# EAGLE board smartstand-usb-dac-amplifier-rev-b (EAGLE 9.2.2)
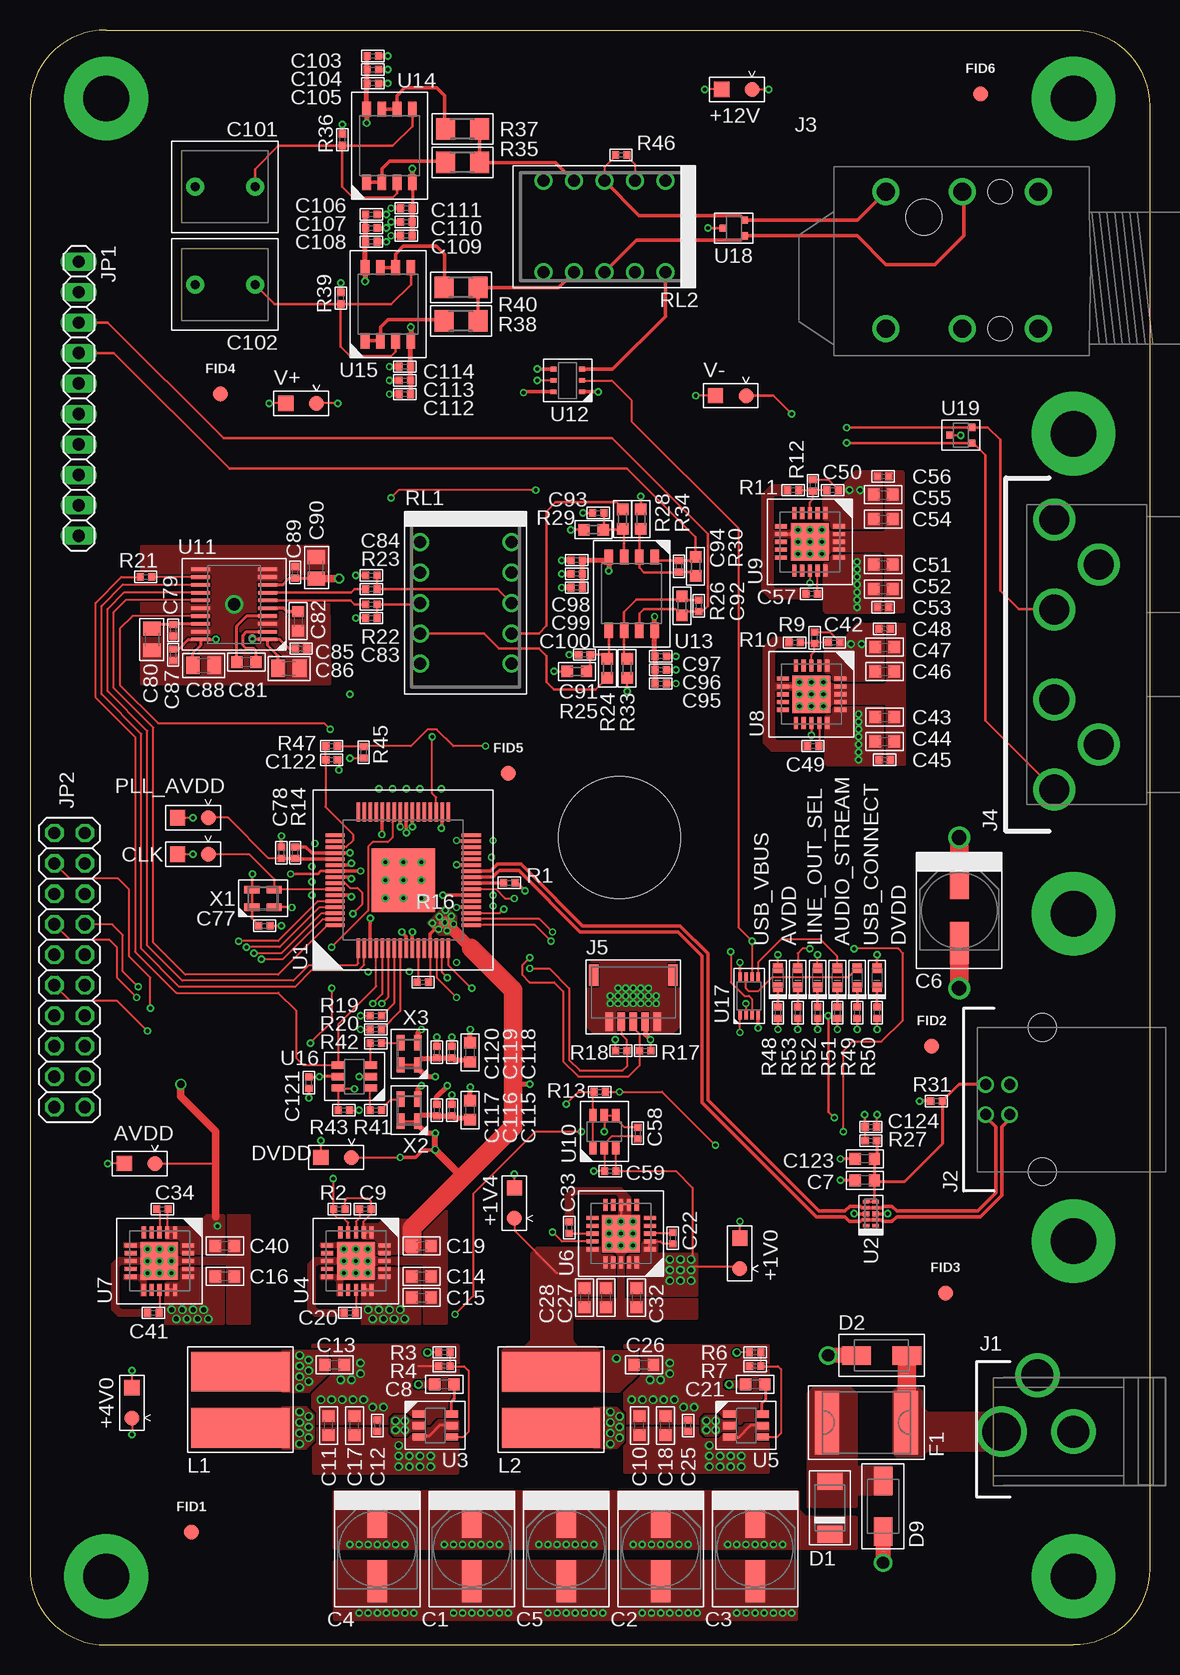
[diagram p12: board, top side]
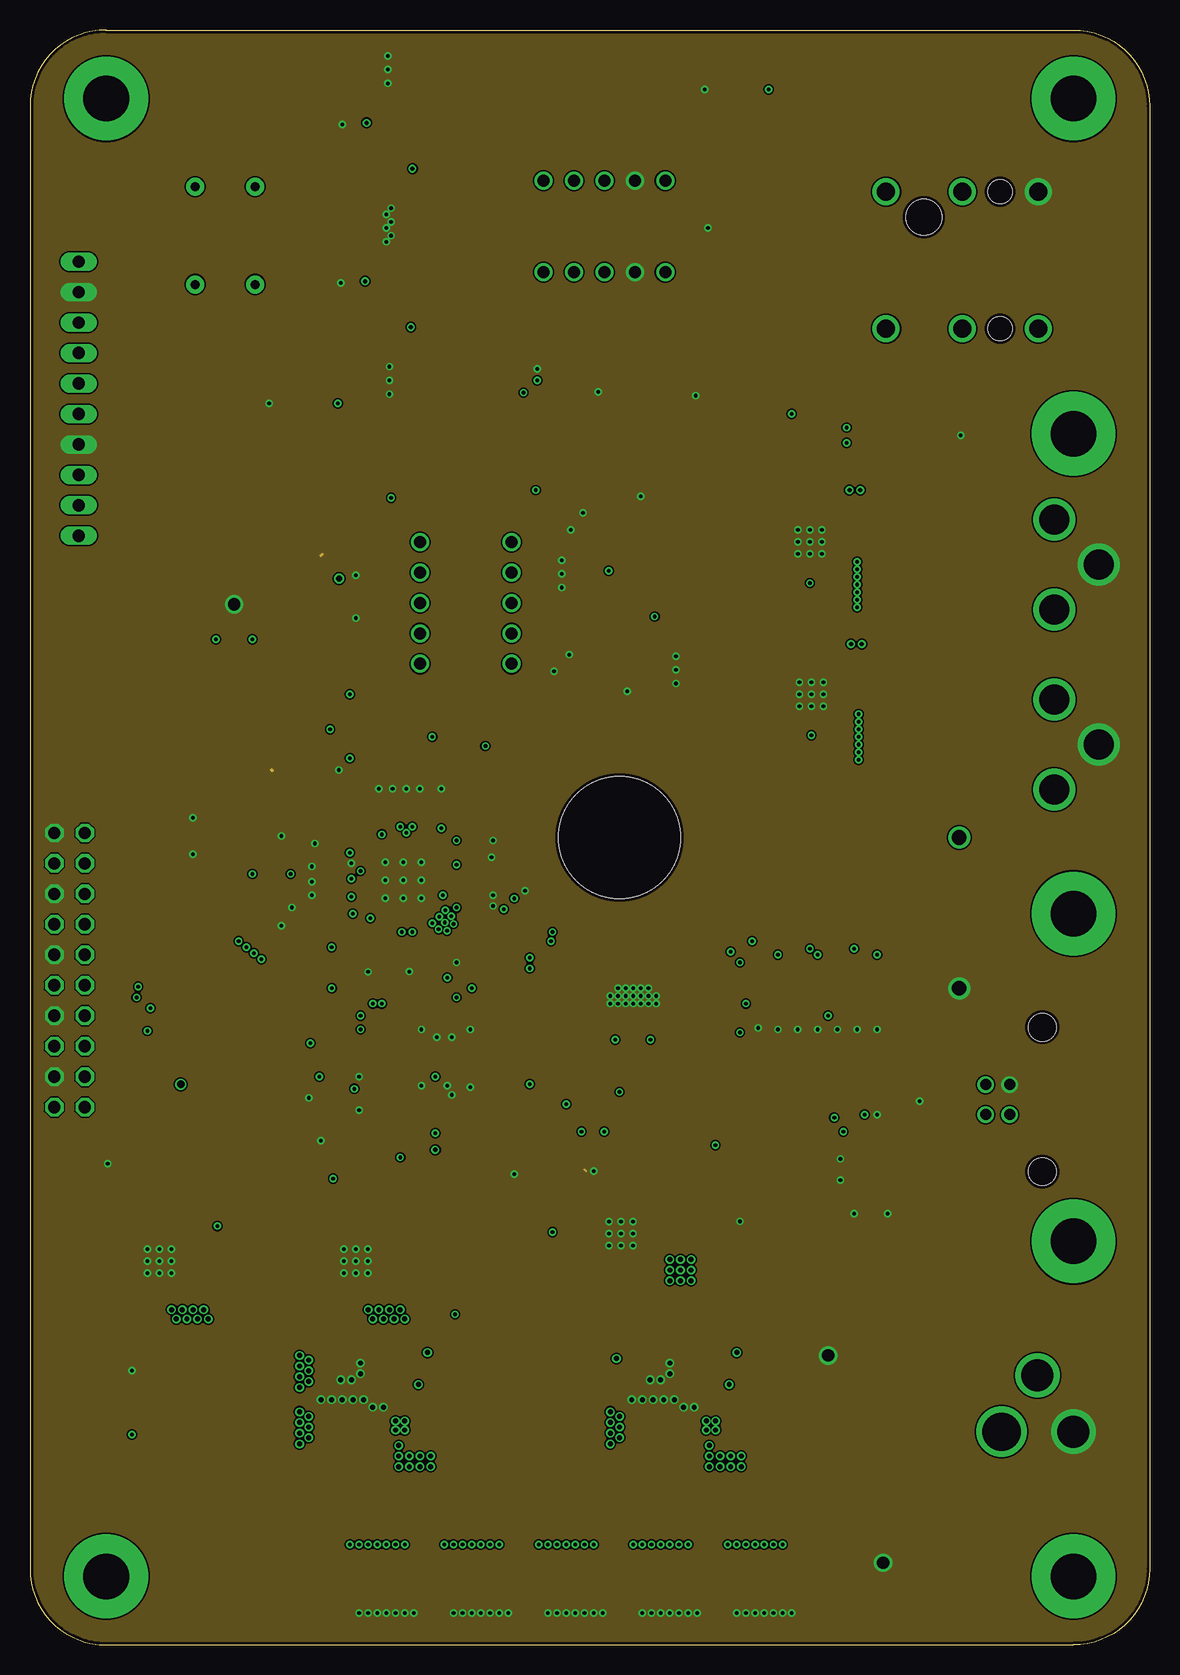
[diagram p13: board, inner layer Route2]
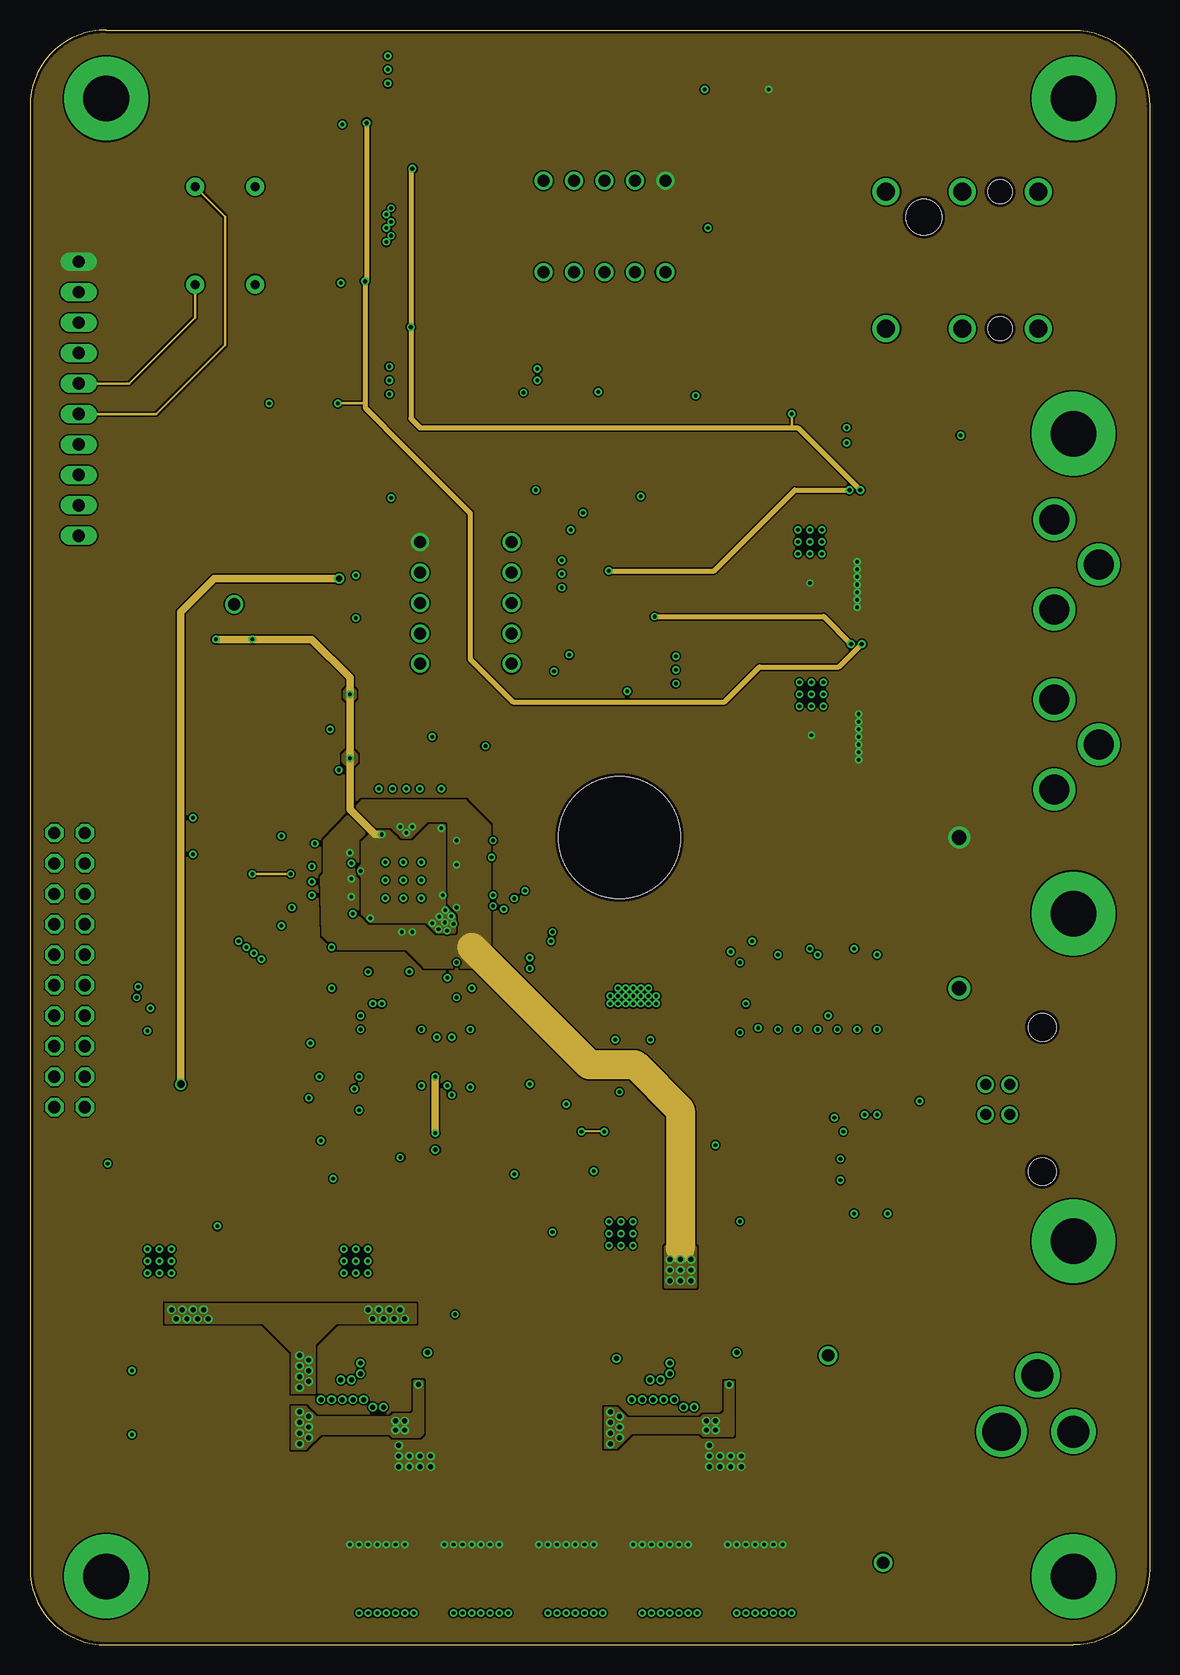
[diagram p14: board, inner layer Route15]
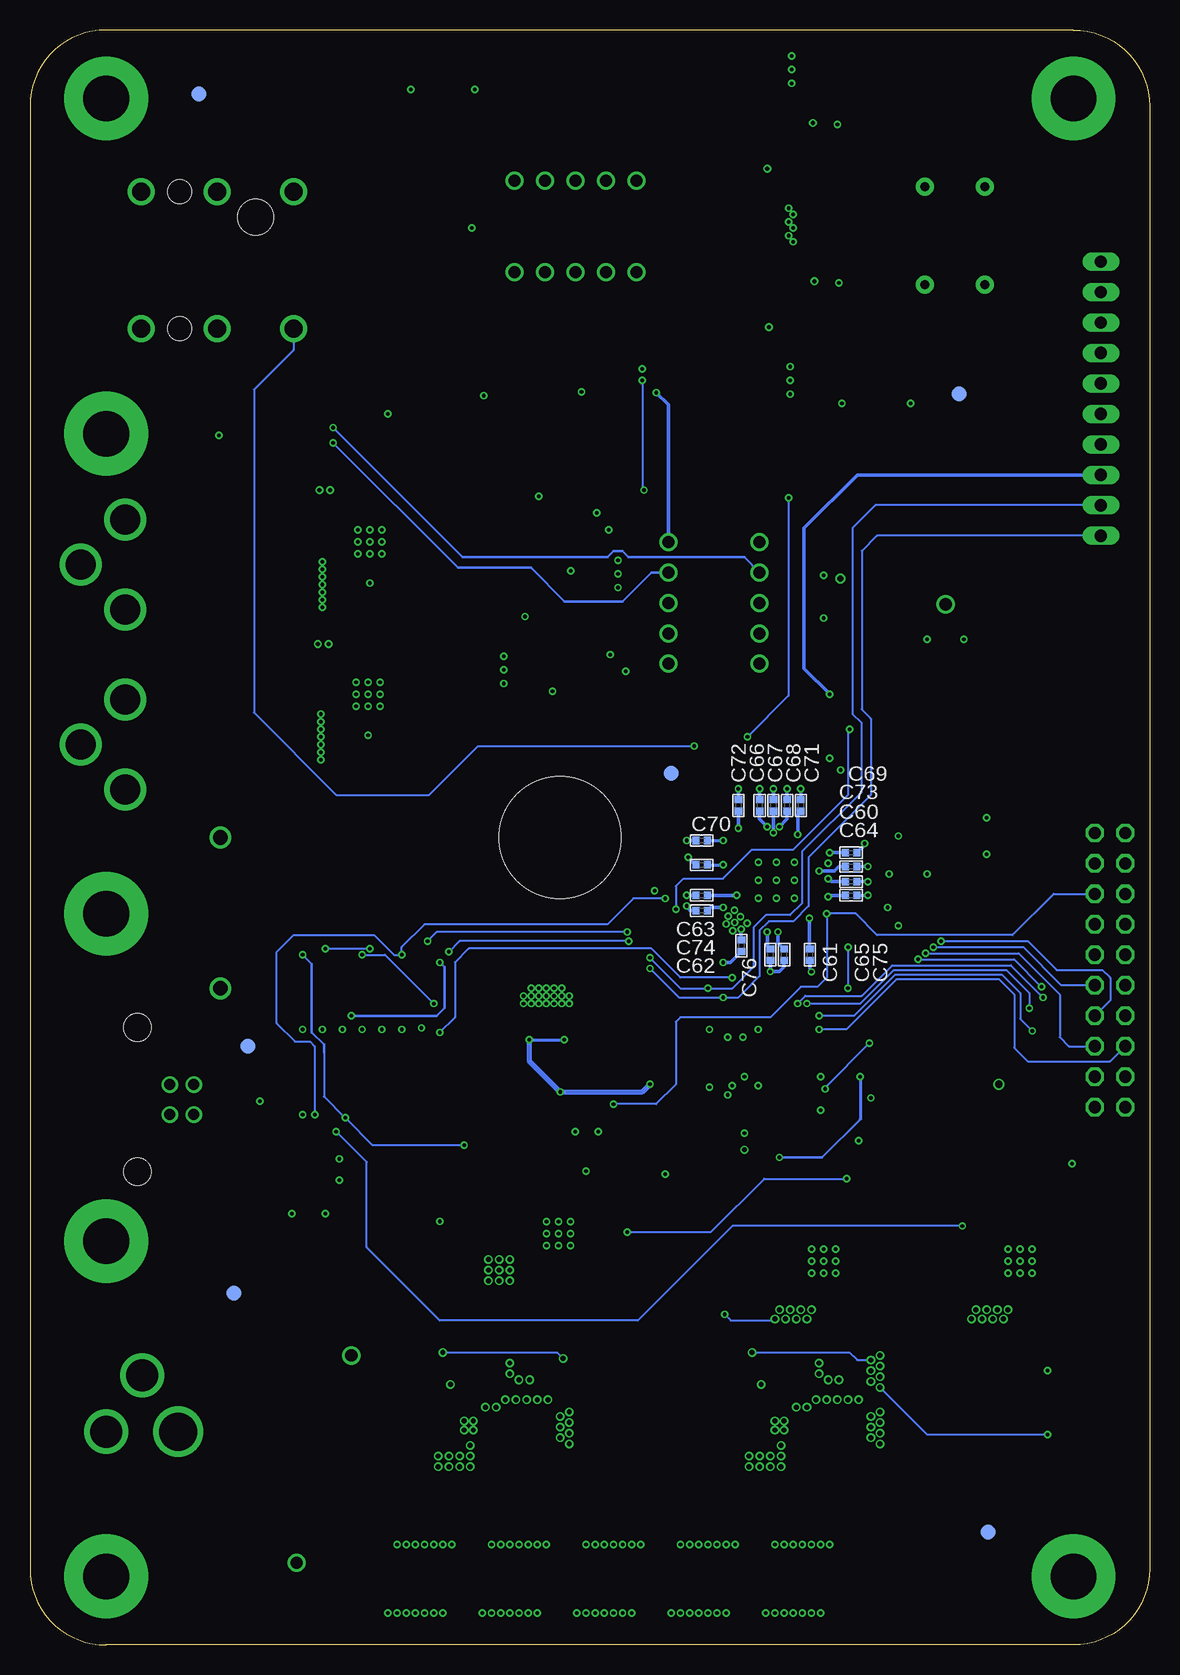
[diagram p15: board, bottom side, seen from below]

Size 93.34 x 134.62 mm. Coordinates in mm from the lower left corner, seen from the top.
Outline: 6.35,134.62 87,134.62 arc-90 93.34,128.27 93.34,6.35 arc-90 87,0 6.35,0 arc-90 0,6.35 0,128.27 arc-90 6.35,134.62
Copper layers (1*2*15*16): Top 0.035mm / dielectric 0.23mm / Route2 0.035mm / dielectric 0.93mm / Route15 0.035mm / dielectric 0.23mm / Bottom 0.035mm
Design rules "MF_Standard_4_Layer": minimum track width 5mil, minimum drill 12mil, track to track 5mil, track to pad 5mil, pad to pad 5mil, via to via 5mil, smd to smd 0mil, copper to edge 10mil, drill to drill 10mil, minimum pad ring 6mil, minimum via ring 6mil, stop-mask expansion 2mil, vias tented up to drill 25mil, thermal gap 10mil
Net classes: 0 default: width 0.152 mm, drill 0.254 mm; 1 USB: width 0.279 mm, drill 0.254 mm; 2 audio_post: clearance 0.381 mm
Holes 10.16 mm at 49.15,67.31

## Footprints (pad centres in the part's own frame; a part is rotated, then mirrored left to right if it is on the bottom)
CHEMICON_F55 = smd 3.5 x 1.6: + -2.7,0; - 2.7,0
C0603 = smd 0.95 x 1: 1 -0.8,0; 2 0.8,0
C0402 = smd 0.59 x 0.64: 1 -0.48,0; 2 0.48,0
C0805 = smd 1.15 x 1.45: 1 -0.9,0; 2 0.9,0
KEMET-5MM-6.0-7.2 = drill 0.75 pad 1.5: P$1 -2.5,0; P$2 2.5,0
SOD128 = smd 1.4 x 2.1: A 2.2,0; C -2.2,0
SMA = smd 2.4 x 1.55: A 2.1,0; C -2.1,0
DIALIGHT-0603 = smd 0.8 x 0.8: 1 -0.8,0; 2 0.8,0
2920L = smd 2 x 5.3: P$1 -3.3,0; P$2 3.3,0
FIDUCIAL_100MIL = smd 1.27 x 1.27: P$1 0,0 | smd 1.27 x 1.27 bottom: P$2 0,0
PJ-002A = drill 3.175: 1 -3,0 | drill 2.667: 2 3,0; 3 0,4.7
292304 = drill 0.92: P$1 1.25,9.6; P$2 -1.25,9.6; P$3 -1.25,7.6; P$4 1.25,7.6 | hole 2.3: -6.02,4.89; 6.02,4.89
NRJ6HH = drill 1.5: R 0,7.23; RN 0,-4.2; S 6.35,7.23; SN 6.35,-4.2; T -6.35,7.23; TN -6.35,-4.2 | hole 2: 3.15,7.23; 3.15,-4.2 | hole 3: -3.2,5.1
PJRAN2X1U = drill 2.5: L_SHUNT 11.25,3.7; L_SLEEVE 7.5,0; L_TIP 3.75,3.7; R_SHUNT -3.75,3.7; R_SLEEVE -7.5,0; R_TIP -11.25,3.7
T1M-SINGLE-5POS = smd 0.6 x 1.55: 1 2,-2.781; 2 1,-2.781; 3 0,-2.781; 4 -1,-2.781; 5 -2,-2.781 | smd 0.8 x 1.8: G1 3.3,1.094; G2 -3.3,1.094
1X10 = drill 1.016 long: 1 -11.43,0; 2 -8.89,0; 3 -6.35,0; 4 -3.81,0; 5 -1.27,0; 6 1.27,0; 7 3.81,0; 8 6.35,0; 9 8.89,0; 10 11.43,0
2X10 = drill 1.016 octagon: 1 -11.43,-1.27; 2 -11.43,1.27; 3 -8.89,-1.27; 4 -8.89,1.27; 5 -6.35,-1.27; 6 -6.35,1.27; 7 -3.81,-1.27; 8 -3.81,1.27; 9 -1.27,-1.27; 10 -1.27,1.27; 11 1.27,-1.27; 12 1.27,1.27; 13 3.81,-1.27; 14 3.81,1.27; 15 6.35,-1.27; 16 6.35,1.27; 17 8.89,-1.27; 18 8.89,1.27; 19 11.43,-1.27; 20 11.43,1.27
TDK-VLP8040 = smd 3.3 x 8.2: P$1 -2.35,0; P$2 2.35,0
R0402 = smd 0.59 x 0.64: 1 -0.48,0; 2 0.48,0
R0603 = smd 0.95 x 0.95: 1 -0.8,0; 2 0.8,0
R1206 = smd 1.6 x 1.803: 1 -1.422,0; 2 1.422,0
TQ2 = drill 1: P$1 -5.08,-3.81; P$2 -2.54,-3.81; P$3 0,-3.81; P$4 2.54,-3.81; P$5 5.08,-3.81; P$6 5.08,3.81; P$7 2.54,3.81; P$8 0,3.81; P$9 -2.54,3.81; P$10 -5.08,3.81
TESTPOINT-1.5-WITH-GND = smd 1.27 x 1.27: G 1.27,0; S -1.27,0
TQFP-64-EXPOSED-PAD = smd 0.28 x 1.6: P$1 -3.75,-5.68; P$2 -3.25,-5.68; P$3 -2.75,-5.68; P$4 -2.25,-5.68; P$5 -1.75,-5.68; P$6 -1.25,-5.68; P$7 -0.75,-5.68; P$8 -0.25,-5.68; P$9 0.25,-5.68; P$10 0.75,-5.68; P$11 1.25,-5.68; P$12 1.75,-5.68; P$13 2.25,-5.68; P$14 2.75,-5.68; P$15 3.25,-5.68; P$16 3.75,-5.68; P$33 3.75,5.68; P$34 3.25,5.68; P$35 2.75,5.68; P$36 2.25,5.68; P$37 1.75,5.68; P$38 1.25,5.68; P$39 0.75,5.68; P$40 0.25,5.68; P$41 -0.25,5.68; P$42 -0.75,5.68; P$43 -1.25,5.68; P$44 -1.75,5.68; P$45 -2.25,5.68; P$46 -2.75,5.68; P$47 -3.25,5.68; P$48 -3.75,5.68 | smd 1.6 x 0.28: P$17 5.68,-3.75; P$18 5.68,-3.25; P$19 5.68,-2.75; P$20 5.68,-2.25; P$21 5.68,-1.75; P$22 5.68,-1.25; P$23 5.68,-0.75; P$24 5.68,-0.25; P$25 5.68,0.25; P$26 5.68,0.75; P$27 5.68,1.25; P$28 5.68,1.75; P$29 5.68,2.25; P$30 5.68,2.75; P$31 5.68,3.25; P$32 5.68,3.75; P$49 -5.68,3.75; P$50 -5.68,3.25; P$51 -5.68,2.75; P$52 -5.68,2.25; P$53 -5.68,1.75; P$54 -5.68,1.25; P$55 -5.68,0.75; P$56 -5.68,0.25; P$57 -5.68,-0.25; P$58 -5.68,-0.75; P$59 -5.68,-1.25; P$60 -5.68,-1.75; P$61 -5.68,-2.25; P$62 -5.68,-2.75; P$63 -5.68,-3.25; P$64 -5.68,-3.75 | smd 5.31 x 5.31: P$65 0,0 | drill 0.305 pad 0.61: P$66 -1.5,1.5; P$67 0,1.5; P$68 1.5,1.5; P$69 -1.5,0; P$70 0,0; P$71 1.5,0; P$72 -1.5,-1.5; P$73 0,-1.5; P$74 1.5,-1.5
R-PUSON-N10 = smd 0.3 x 0.55: P$1 -1,-0.385; P$2 -0.5,-0.385; P$4 0.5,-0.385; P$5 1,-0.385; P$6 1,0.385; P$7 0.5,0.385; P$9 -0.5,0.385; P$10 -1,0.385 | smd 0.4 x 0.55: P$3 0,-0.385; P$8 0,0.385
R-PDSO-G6-DBV = smd 0.6 x 1.1: 1 -0.95,-1.35; 2 0,-1.35; 3 0.95,-1.35; 4 0.95,1.35; 5 0,1.35; 6 -0.95,1.35
S-PVQFN-N20 = smd 0.35 x 1: P$1 -1.3,-2.4; P$2 -0.65,-2.4; P$3 0,-2.4; P$4 0.65,-2.4; P$5 1.3,-2.4; P$11 1.3,2.4; P$12 0.65,2.4; P$13 0,2.4; P$14 -0.65,2.4; P$15 -1.3,2.4 | smd 1 x 0.35: P$6 2.4,-1.3; P$7 2.4,-0.65; P$8 2.4,0; P$9 2.4,0.65; P$10 2.4,1.3; P$16 -2.4,1.3; P$17 -2.4,0.65; P$18 -2.4,0; P$19 -2.4,-0.65; P$20 -2.4,-1.3 | drill 0.305 pad 0.406: P$21 0,0; P$22 -1,0; P$23 1,0; P$24 1,1; P$25 0,1; P$26 -1,1; P$27 -1,-1; P$28 0,-1; P$29 1,-1 | smd 3.15 x 3.15: P$EP 0,0
R-PDSO-G20 = smd 0.3 x 1.6: P$1 -2.925,-2.8; P$2 -2.275,-2.8; P$3 -1.625,-2.8; P$4 -0.975,-2.8; P$5 -0.325,-2.8; P$6 0.325,-2.8; P$7 0.975,-2.8; P$8 1.625,-2.8; P$9 2.275,-2.8; P$10 2.925,-2.8; P$11 2.925,2.8; P$12 2.275,2.8; P$13 1.625,2.8; P$14 0.975,2.8; P$15 0.325,2.8; P$16 -0.325,2.8; P$17 -0.975,2.8; P$18 -1.625,2.8; P$19 -2.275,2.8; P$20 -2.925,2.8
SOT-457 = smd 0.5 x 0.4: 1 -1.2,0.95; 2 -1.2,0; 3 -1.2,-0.95; 4 1.2,-0.95; 5 1.2,0; 6 1.2,0.95
DMP8 = smd 0.72 x 1.27: P$1 -1.905,-3.05; P$2 -0.635,-3.05; P$3 0.635,-3.05; P$4 1.905,-3.05; P$5 1.905,3.05; P$6 0.635,3.05; P$7 -0.635,3.05; P$8 -1.905,3.05
R-PDSO-G8-DCU = smd 0.3 x 0.8: 1 -0.75,-1.55; 2 -0.25,-1.55; 3 0.25,-1.55; 4 0.75,-1.55; 5 0.75,1.55; 6 0.25,1.55; 7 -0.25,1.55; 8 -0.75,1.55
R-PDSO-G3 = smd 0.6 x 0.55: 1 0.65,0.925; 2 -0.65,0.925; 3 0,-0.925
KC2520C = smd 1.27 x 0.635: P$1 -0.925,-0.725; P$2 0.925,-0.725; P$3 0.925,0.725; P$4 -0.925,0.725

## Placement (x,y rotation side)
C1  47uF  [CHEMICON_F55]  36.83,8 270 top
C2  47uF  [CHEMICON_F55]  52.58,8 270 top
C3  47uF  [CHEMICON_F55]  60.45,8 270 top
C4  47uF  [CHEMICON_F55]  28.96,8 270 top
C5  47uF  [CHEMICON_F55]  44.7,8 270 top
C6  47uF  [CHEMICON_F55]  77.47,61.21 270 top
C7  1uF  [C0603]  69.6,38.73 180 top
C8  0.1uF  [C0603]  34.54,21.72 180 top
C9  0.01uF  [C0402]  27.94,36.32 180 top
C10  10uF  [C0603]  50.8,18.29 90 top
C11  10uF  [C0603]  24.89,18.29 90 top
C12  0.1uF  [C0402]  28.96,18.29 90 top
C13  22uF  [C0603]  25.4,23.37 0 top
C14  22uF  [C0603]  32.64,30.73 0 top
C15  22uF  [C0603]  32.64,28.96 0 top
C16  22uF  [C0603]  16.26,30.73 0 top
C17  10uF  [C0603]  27.05,18.29 90 top
C18  10uF  [C0603]  52.96,18.29 90 top
C19  22uF  [C0603]  32.64,33.27 0 top
C20  0.01uF  [C0402]  26.67,27.69 180 top
C21  0.1uF  [C0603]  60.45,21.72 180 top
C22  0.01uF  [C0402]  53.59,33.91 90 top
C25  0.1uF  [C0402]  54.86,18.29 90 top
C26  22uF  [C0603]  51.18,23.37 0 top
C27  22uF  [C0603]  48.01,28.96 270 top
C28  22uF  [C0603]  46.23,28.96 270 top
C32  22uF  [C0603]  50.55,28.96 270 top
C33  0.01uF  [C0402]  44.96,34.8 90 top
C34  0.01uF  [C0402]  11.05,36.32 180 top
C40  22uF  [C0603]  16.26,33.27 0 top
C41  0.01uF  [C0402]  10.29,27.69 180 top
C42  0.01uF  [C0402]  67.06,83.57 180 top
C43  22uF  [C0603]  71.25,77.34 0 top
C44  1uF  [C0603]  71.25,75.31 0 top
C45  0.1uF  [C0402]  71.25,73.79 0 top
C46  22uF  [C0603]  71.25,81.15 0 top
C47  1uF  [C0603]  71.25,83.19 0 top
C48  0.1uF  [C0402]  71.25,84.71 0 top
C49  0.01uF  [C0402]  65.28,74.93 180 top
C50  0.01uF  [C0402]  66.93,96.27 180 top
C51  22uF  [C0603]  71.12,90.04 0 top
C52  1uF  [C0603]  71.12,88.01 0 top
C53  0.1uF  [C0402]  71.12,86.49 0 top
C54  22uF  [C0603]  71.12,93.85 0 top
C55  1uF  [C0603]  71.12,95.89 0 top
C56  0.1uF  [C0402]  71.12,97.41 0 top
C57  0.01uF  [C0402]  65.15,87.63 180 top
C58  0.01uF  [C0402]  50.67,42.67 90 top
C59  0.01uF  [C0402]  48.39,39.5 0 top
C60  0.1uF  [C0402]  24.89,63.63 0 bottom
C61  0.1uF  [C0402]  31.62,57.53 270 bottom
C62  0.1uF  [C0402]  37.34,61.21 180 bottom
C63  0.1uF  [C0402]  37.34,65.02 180 bottom
C64  0.1uF  [C0402]  24.89,62.48 0 bottom
C65  0.1uF  [C0402]  30.48,57.53 270 bottom
C66  0.1uF  [C0402]  32.51,69.98 90 bottom
C67  0.1uF  [C0402]  31.37,69.98 90 bottom
C68  0.1uF  [C0402]  30.23,69.98 90 bottom
C69  0.1uF  [C0402]  24.89,66.04 0 bottom
C70  0.1uF  [C0402]  37.34,67.06 180 bottom
C71  0.1uF  [C0402]  29.08,69.98 90 bottom
C72  0.1uF  [C0402]  34.29,69.98 90 bottom
C73  0.1uF  [C0402]  24.89,64.9 0 bottom
C74  0.1uF  [C0402]  37.34,62.48 180 bottom
C75  0.1uF  [C0402]  28.32,57.53 270 bottom
C76  0.1uF  [C0402]  34.04,58.29 270 bottom
C77  0.1uF  [C0402]  19.56,59.94 180 top
C78  0.1uF  [C0402]  20.95,66.04 90 top
C79  0.1uF  [C0402]  11.94,84.58 270 top
C80  10uF  [C0805]  10.16,83.82 270 top
C81  2.2uF  [C0603]  18.03,81.92 180 top
C82  2.2uF  [C0603]  22.35,85.34 270 top
C83  2.2nF, C0G  [C0402]  28.45,85.6 180 top
C84  2.2nF, C0G  [C0402]  28.45,89.15 180 top
C85  0.1uF  [C0402]  22.61,83.06 0 top
C86  10uF  [C0805]  21.59,81.41 0 top
C87  0.1uF  [C0402]  11.94,82.55 270 top
C88  10uF  [C0805]  14.48,81.66 0 top
C89  0.1uF  [C0402]  22.1,89.41 90 top
C90  10uF  [C0805]  23.88,89.79 90 top
C91  220pF, C0G  [C0402]  46.23,82.55 180 top
C92  220pF, C0G  [C0402]  55.75,86.61 270 top
C93  220pF, C0G  [C0402]  47.37,94.36 180 top
C94  220pF, C0G  [C0402]  54.1,89.92 90 top
C95  0.1uF  [C0402]  52.58,80.14 0 top
C96  0.01uF  [C0402]  52.58,81.28 0 top
C97  27pF  [C0402]  52.58,82.42 0 top
C98  0.1uF  [C0402]  45.59,90.42 180 top
C99  0.01uF  [C0402]  45.59,89.28 180 top
C100  27pF  [C0402]  45.59,88.14 180 top
C101  2.2uF  [KEMET-5MM-6.0-7.2]  16.26,121.54 0 top
C102  2.2uF  [KEMET-5MM-6.0-7.2]  16.26,113.41 0 top
C103  0.1uF  [C0402]  28.57,132.46 0 top
C104  0.01uF  [C0402]  28.57,131.32 0 top
C105  27pF  [C0402]  28.57,130.18 0 top
C106  0.1uF  [C0402]  28.45,119.25 0 top
C107  0.01uF  [C0402]  28.45,118.11 0 top
C108  27pF  [C0402]  28.45,116.97 0 top
C109  0.1uF  [C0402]  31.37,117.47 180 top
C110  0.01uF  [C0402]  31.37,118.62 180 top
C111  27pF  [C0402]  31.37,119.76 180 top
C112  0.1uF  [C0402]  31.24,104.27 180 top
C113  0.01uF  [C0402]  31.24,105.41 180 top
C114  27pF  [C0402]  31.24,106.55 180 top
C115  1uF  [C0603]  36.7,44.58 90 top
C116  0.1uF  [C0402]  35.18,44.58 90 top
C117  0.01uF  [C0402]  33.91,44.58 90 top
C118  1uF  [C0603]  36.7,49.4 90 top
C119  0.1uF  [C0402]  35.18,49.4 90 top
C120  0.01uF  [C0402]  33.91,49.4 90 top
C121  0.1uF  [C0402]  23.24,46.86 270 top
C122  0.1uF  [C0402]  25.15,73.79 0 top
C123  1uF  [C0603]  69.6,40.51 180 top
C124  0.1uF  [C0402]  70.1,43.18 0 top
D1  5A  [SOD128]  66.67,11.43 90 top
D2  13.6V  [SMA]  70.99,24.13 180 top
D3  1.8V, 10mA  [DIALIGHT-0603]  62.36,55.63 270 top
D4  1.8V, 10mA  [DIALIGHT-0603]  68.96,55.63 270 top
D5  1.8V, 10mA  [DIALIGHT-0603]  70.61,55.63 270 top
D6  1.8V, 10mA  [DIALIGHT-0603]  67.31,55.63 270 top
D7  1.8V, 10mA  [DIALIGHT-0603]  65.66,55.63 270 top
D8  1.8V, 10mA  [DIALIGHT-0603]  64.01,55.63 270 top
D9  13.6V  [SMA]  71.12,11.56 270 top
F1  0.6A  [2920L]  69.72,18.54 180 top
FID1  FIDUCIAL_100MIL  [FIDUCIAL_100MIL]  13.46,9.4 0 top
FID2  FIDUCIAL_100MIL  [FIDUCIAL_100MIL]  75.18,49.91 0 top
FID3  FIDUCIAL_100MIL  [FIDUCIAL_100MIL]  76.33,29.34 0 top
FID4  FIDUCIAL_100MIL  [FIDUCIAL_100MIL]  15.88,104.27 0 top
FID5  FIDUCIAL_100MIL  [FIDUCIAL_100MIL]  39.88,72.64 0 top
FID6  FIDUCIAL_100MIL  [FIDUCIAL_100MIL]  79.25,129.29 0 top
J1  PJ-002A  [PJ-002A]  84,17.78 0 top
J2  292304-1  [292304]  89.28,45.47 90 top
J3  NRJ6HH  [NRJ6HH]  77.72,113.92 0 top
J4  PJRAN2X1U01AUX  [PJRAN2X1U]  89.1,82.55 90 top
J5  T1M-5POS  [T1M-SINGLE-5POS]  50.29,54.74 0 top
JP1  [1X10]  4.06,103.89 270 top
JP2  [2X10]  3.3,56.26 90 top
L1  2.2uH  [TDK-VLP8040]  17.53,20.45 270 top
L2  2.2uH  [TDK-VLP8040]  43.43,20.45 270 top
R1  43.2  [R0402]  39.95,63.53 180 top
R2  10K  [R0402]  25.78,36.32 180 top
R3  40.2K, 1%  [R0402]  34.54,24.38 180 top
R4  10K, 1%  [R0402]  34.54,23.24 0 top
R6  9.53K, 1%  [R0402]  60.45,24.38 180 top
R7  10K, 1%  [R0402]  60.45,23.24 0 top
R9  66.5K  [R0402]  65.41,83.95 90 top
R10  9.76K  [R0402]  63.75,83.57 0 top
R11  1.15M  [R0402]  65.28,96.65 90 top
R12  137K  [R0402]  63.63,96.27 0 top
R13  10K  [R0402]  47.5,46.1 0 top
R14  4.7  [R0402]  22.1,66.04 90 top
R16  1K  [R0402]  32.77,55.25 0 top
R17  4.7K  [R0402]  51.31,49.53 0 top
R18  4.7K  [R0402]  49.28,49.53 180 top
R19  33  [R0402]  28.83,52.45 180 top
R20  33  [R0402]  28.83,51.31 180 top
R21  0  [R0402]  9.65,89.03 180 top
R22  470, 0.1%  [R0402]  28.45,86.74 0 top
R23  470, 0.1%  [R0402]  28.45,88.01 0 top
R24  270, 1%  [R0603]  48.13,81.41 90 top
R25  10K, 0.1%  [R0603]  45.59,81.15 0 top
R26  1.5K, 0.1%  [R0603]  54.36,86.61 270 top
R27  10K  [R0402]  70.1,42.04 180 top
R28  270, 1%  [R0603]  49.4,93.85 270 top
R29  10K, 0.1%  [R0603]  46.99,92.96 0 top
R30  1.5K, 0.1%  [R0603]  55.5,89.92 90 top
R31  18K  [R0402]  75.56,45.34 0 top
R33  1K, 0.1%  [R0603]  49.78,81.41 270 top
R34  1K, 0.1%  [R0603]  50.93,93.85 270 top
R35  1, 1%  [R1206]  36.07,123.57 0 top
R36  40.2K, 0.1%  [R0402]  26.04,125.48 270 top
R37  1, 1%  [R1206]  36.07,126.37 0 top
R38  1, 1%  [R1206]  35.94,110.36 0 top
R39  40.2K, 0.1%  [R0402]  25.91,112.27 270 top
R40  1, 1%  [R1206]  35.94,113.16 0 top
R41  0  [R0402]  28.83,44.58 0 top
R42  0  [R0402]  28.83,50.17 0 top
R43  100K  [R0402]  26.16,44.58 180 top
R45  100K  [R0402]  27.81,74.42 270 top
R46  10K  [R0402]  49.28,124.21 180 top
R47  49.9K  [R0402]  25.15,74.93 180 top
R48  330  [R0402]  62.36,52.7 90 top
R49  220  [R0402]  68.96,52.7 90 top
R50  220  [R0402]  70.61,52.7 90 top
R51  220  [R0402]  67.31,52.7 90 top
R52  220  [R0402]  65.66,52.7 90 top
R53  220  [R0402]  64.01,52.7 90 top
RL1  TQ2-12V  [TQ2]  36.32,86.87 270 top
RL2  TQ2-12V  [TQ2]  47.88,118.24 180 top
TP1  TESTPOINT-WITH-GND  [TESTPOINT-1.5-WITH-GND]  13.59,65.91 180 top
TP2  TESTPOINT-WITH-GND  [TESTPOINT-1.5-WITH-GND]  58.93,129.67 180 top
TP3  TESTPOINT-WITH-GND  [TESTPOINT-1.5-WITH-GND]  8.51,20.19 90 top
TP4  TESTPOINT-WITH-GND  [TESTPOINT-1.5-WITH-GND]  13.59,68.96 180 top
TP5  TESTPOINT-WITH-GND  [TESTPOINT-1.5-WITH-GND]  9.14,40.13 180 top
TP6  TESTPOINT-WITH-GND  [TESTPOINT-1.5-WITH-GND]  25.53,40.64 180 top
TP7  TESTPOINT-WITH-GND  [TESTPOINT-1.5-WITH-GND]  40.39,36.83 90 top
TP8  TESTPOINT-WITH-GND  [TESTPOINT-1.5-WITH-GND]  59.18,32.64 90 top
TP9  TESTPOINT-WITH-GND  [TESTPOINT-1.5-WITH-GND]  22.61,103.5 180 top
TP10  TESTPOINT-WITH-GND  [TESTPOINT-1.5-WITH-GND]  58.42,104.14 180 top
U1  XUF208-256-TQ64  [TQFP-64-EXPOSED-PAD]  31.11,63.75 0 top
U2  TPD4E02B04DQA  [R-PUSON-N10]  70.1,35.94 90 top
U3  TPS563201DDC  [R-PDSO-G6-DBV]  33.78,18.29 270 top
U4  TPS7A8300RGW  [S-PVQFN-N20]  27.18,32 180 top
U5  TPS563201DDC  [R-PDSO-G6-DBV]  59.69,18.29 270 top
U6  TPS7A8300RGW  [S-PVQFN-N20]  49.28,34.29 90 top
U7  TPS7A8300RGW  [S-PVQFN-N20]  10.79,32 180 top
U8  TPS7A4701RGW  [S-PVQFN-N20]  65.15,79.25 180 top
U9  TPS7A3301RGW  [S-PVQFN-N20]  65.02,91.95 180 top
U10  TPS3702  [R-PDSO-G6-DBV]  47.88,42.8 0 top
U11  PCM5102A  [R-PDSO-G20]  17.02,86.74 90 top
U12  SZNUD3124  [SOT-457]  44.83,105.41 180 top
U13  NJM2068M  [DMP8]  50.16,87.63 180 top
U14  NJM4556AM  [DMP8]  29.97,124.97 0 top
U15  NJM4556AM  [DMP8]  29.84,111.76 0 top
U16  TS5A3159DBV  [R-PDSO-G6-DBV]  27.05,47.37 90 top
U17  SN74LVC3G34DCU  [R-PDSO-G8-DCU]  59.94,54.1 0 top
U18  TPD2E007DCK  [R-PDSO-G3]  58.67,118.11 270 top
U19  TPD2E007DCK  [R-PDSO-G3]  77.6,100.84 270 top
X1  24MHz  [KC2520C]  19.43,62.23 0 top
X2  22.5792MHz  [KC2520C]  31.62,44.58 90 top
X3  24.576MHz  [KC2520C]  31.62,49.28 90 top

## Tracks (layer width: path | path; a pad name or v marks a point on that pad's centre or on a via)
!RESET  (via drill 0.3)
  Top 0.152: U10.1 U10.6 46.93,46.01 R13.1 45.72,46.1 v44.7,45.09 | U1.P$57 26.29,63.5 26.67,63.12 27.3,63.12 27.69,62.74 27.69,61.72 v26.92,60.96
  Bottom 0.152: v44.7,45.09 41.15,45.09 39.5,46.74 39.5,51.94 39.12,52.32 31.62,52.32 29.08,54.86 27.69,54.86 26.92,55.63 26.92,57.15 v26.92,60.96 24.51,60.96 22.73,59.18 11.43,59.18 8,62.61 JP2.15
+1V0  (via drill 0.3, 0.41)
  Top 0.152: 51.69,33.66 52.58,33.66 52.8,33.43 C22.1 | U10.3 48.83,39.54 C59.2 53.85,39.5 55.24,38.1 55.24,32.13 | 55.24,31.5 59.05,31.5 TP8.S
  Top 0.254: U6.P$2 U6.P$1 U6.P$2 51.69,33.66
  Top 0.279: v26.67,66.04 26.76,66 U1.P$52 23.5,66 22.99,66.52 R14.2 | U1.P$41 v30.86,68.2 | U1.P$40 v31.36,67.7 v31.37,67.69 | U1.P$39 31.86,68.21 v31.88,68.2 | U1.P$56 26.67,64 v26.8,63.88 | U1.P$59 26.65,62.5 v26.8,62.36 | U1.P$10 31.86,59.42 v31.88,59.44 | U1.P$27 35.58,65 v35.56,65.02 | U1.P$20 35.6,61.5 v35.56,61.47 | U1.P$31 35.61,67 v35.56,67.06 | U1.P$9 31.36,59.06 v30.99,59.44
  Route15 2.413: 36.83,58.17 46.61,48.39 50.42,48.39 54.23,44.58 54.23,33.08
  Bottom 0.254: C70.1 v35.56,67.06 | C63.1 v35.56,65.02
  Bottom 0.279: C62.1 36.6,61.47 v35.56,61.47 | C65.1 30.99,58.52 v30.99,59.44 | C64.1 26.67,62.48 v26.8,62.36 | C60.1 26.54,63.63 v26.8,63.88 | C69.1 v26.67,66.04 | C67.1 v31.37,67.69 | C66.1 32.51,68.83 v31.88,68.2 | v30.86,68.2 30.23,68.83 C68.1 | C61.1 31.88,58.27 v31.88,59.44
  other vias: 53.34,32.13 54.23,32.13 53.34,31.24 54.23,31.24 53.34,30.35 54.23,30.35 55.12,30.35 55.12,31.24 55.12,32.13
  pour Top (rank 2, no thermals): 51.31,33.78 52.32,33.78 52.32,32.64 55.63,32.64 55.63,29.08 49.78,29.08 49.78,32.26
  pour Route15 (rank 2, no thermals): 38.35,68.33 36.32,70.36 27.68,70.36 24.51,67.06 24.51,64.26 24.26,64.01 24.38,59.18 25.53,58.04 31.37,58.04 32.89,56.52 36.83,56.52 38.35,58.04
  pour Route15 (rank 2): 55.5,29.84 52.96,29.84 52.96,33.15 53.21,33.4 55.24,33.4 55.5,33.15
+1V4  (via drill 0.41)
  Top 0.152: R6.2 v58.93,24.38 | TP7.S 40.39,34.54 43.94,30.99
  Bottom 0.152: v58.93,24.38 49.4,24.38 v48.9,23.88
  pour Top (rank 2, no thermals): 47.5,21.08 39.37,21.08 39.37,24.51 39.75,24.89 41.27,24.89 41.78,25.4 41.78,32.64 42.29,33.15 48.9,33.15 48.9,28.96 45.72,28.96 45.21,28.45 45.21,25.4 45.59,24.89 47.12,24.89 47.5,24.51
  pour Top (no thermals): 50.67,24.51 50.67,22.61 49.15,21.08 46.99,21.08 46.99,24.51
+4V0  (via drill 0.3, 0.41)
  Top 0.152: v47.88,42.8 U10.5 U10.4 48.83,43.88 49.56,43.15 C58.2 | v45.97,42.8 42.16,42.8 36.96,37.59 36.96,29.08 v35.43,27.56 | TP3.S v8.51,17.53 | R3.2 v33.15,24.38
  Top 0.254: U4.P$15 U4.P$14 | U7.P$15 U7.P$14
  Route15 0.152: v47.88,42.8 v45.97,42.8
  Bottom 0.152: v33.15,24.38 25.02,24.38 24.38,23.75 v23.24,23.75 | v8.51,17.53 18.54,17.53 v22.48,21.46 | v35.43,27.56 34.92,27.05 31.24,27.05 v31.24,27.18
  other vias: 22.48,23.24 22.48,22.35 23.24,22.86 23.24,21.97 22.48,24.13 12.19,27.18 11.81,27.94 13.97,27.18 12.7,27.94 13.08,27.18 13.59,27.94 14.86,27.18 14.48,27.94 28.57,27.18 28.19,27.94 29.46,27.18 29.08,27.94 30.35,27.18 29.97,27.94 30.86,27.94
  pour Top (no thermals): 24.77,24.51 24.77,22.61 23.24,21.08 21.08,21.08 21.08,24.51
  pour Top (no thermals): 32.51,31.37 27.69,31.37 27.69,26.8 32.51,26.8
  pour Top (no thermals): 16.13,31.37 12.57,31.37 11.3,30.1 11.3,26.8 16.13,26.8
  pour Route15 (no thermals): 23.75,20.96 21.84,20.96 21.84,24.38 19.43,26.8 11.3,26.8 11.3,28.45 32.13,28.45 32.13,26.8 25.53,26.8 23.75,25.02
+12V  (via drill 0.3, 0.41, 1.22)
  Top 0.152: U8.P$13 v65.15,75.82 | TP2.S v61.59,129.67 | U9.P$13 v65.02,88.52
  Top 0.254: U5.5 60.07,18.29 59.05,17.27 58.41,17.27 U5.3 | U3.5 34.16,18.29 33.27,17.4 32.49,17.4 U3.3
  Top 1.524: C6.+ v77.47,67.31
  other vias: 58.42,15.75 56.64,14.86 59.31,15.75 56.64,15.75 57.53,14.86 57.53,15.75 58.42,14.86 61.21,8.38 60.45,8.38 59.69,8.38 53.34,8.38 52.58,8.38 51.82,8.38 45.47,8.38 44.7,8.38 43.94,8.38 37.59,8.38 36.83,8.38 36.07,8.38 29.72,8.38 28.96,8.38 28.19,8.38 69.09,73.79 69.09,74.42 69.09,75.06 69.09,75.69 69.09,76.33 69.09,76.96 69.09,77.6 68.96,86.49 68.96,87.12 68.96,87.76 68.96,88.39 68.96,89.03 68.96,89.66 68.96,90.3 30.73,16.64 30.73,14.86 32.51,15.75 33.4,14.86 30.73,15.75 31.62,14.86 31.62,15.75 32.51,14.86 56.64,16.64 27.43,8.38 26.67,8.38 30.48,8.38 31.24,8.38 58.93,8.38 58.17,8.38 61.98,8.38 62.74,8.38 51.05,8.38 50.29,8.38 54.1,8.38 54.86,8.38 43.18,8.38 42.42,8.38 46.23,8.38 46.99,8.38 35.31,8.38 38.35,8.38 39.12,8.38 34.54,8.38 33.4,15.75 59.31,14.86
  pour Top (rank 2, no thermals): 59.69,18.41 59.44,18.16 49.53,18.16 49.53,14.35 61.59,14.35 61.59,18.41
  pour Top (no thermals): 63.88,12.83 63.88,11.43 64.64,10.67 68.83,10.67 68.83,8 25.4,8 25.4,12.83
  pour Top (rank 2, no thermals): 34.04,18.67 33.4,18.03 23.62,18.03 23.62,14.35 35.69,14.35 35.69,18.67
  pour Top (no thermals): 71.12,78.11 67.06,78.11 66.29,77.34 66.29,73.53 66.42,73.41 71.12,73.41
  pour Top (no thermals): 70.99,90.81 66.93,90.81 66.17,90.04 66.17,86.23 66.29,86.11 70.99,86.11
  pour Route15 (rank 3, no thermals): 6.35,0 87,0 arc90 93.34,6.35 93.34,128.27 arc90 87,134.62 6.35,134.62 arc90 0,128.27 0,6.35 arc90
  pour Top (no thermals): 64.08,10.67 64.26,10.67 64.26,10.5 62.74,10.67
  pour Top (no thermals): 25.4,12.83 64.01,12.83 64.01,11.18 64.52,10.67 65.41,10.67 65.91,10.16 65.91,8 25.4,8
ADJUSTED_LEFT
  Route15 0.203: JP1.6 10.54,102.62 16.26,108.33 16.26,119.04 C101.P$1
ADJUSTED_RIGHT
  Route15 0.203: JP1.5 8.26,105.16 13.76,110.66 C102.P$1
AGND  (via drill 0.3, 0.41, 1.02, 1.22)
  Top 0.152: U6.P$23 U6.P$8 U6.P$7 | v46.99,39.5 C59.1 47.88,39.53 U10.2 47.88,41.78 48.51,42.42 50.45,42.42 C58.1 | R43.1 v27.43,44.58 | TP2.G v56.26,129.67 | TP3.G v8.51,22.86 | TP7.G v40.39,39.24 | TP5.G v6.48,40.13 | TP6.G v24.26,42.04 | TP10.G v55.5,104.14 | TP9.G v19.94,103.5 | TP8.G v59.18,35.31 | U19.3 v77.6,100.84 | R46.1 49.76,124.11 50.42,123.44 RL2.P$2 | TP4.G v13.59,68.96 | TP1.G v13.59,65.91 | C124.2 70.58,44.17 v70.61,44.2 | v25.75,72.93 25.75,73.66 C122.2 | R4.1 32.38,23.24
  Top 0.203: C93.2 v46.1,94.36 | R29.1 v45.09,92.96 | R48.1 v62.36,51.31 | R53.1 v64.01,51.31 | R52.1 v65.66,51.31 | R51.1 v67.31,51.31 | R49.1 v68.96,51.31 | R50.1 v70.61,51.31 | X1.P$2 21.81,61.51 v21.84,61.47 | C77.1 v20.95,59.94 | R34.1 v50.93,95.76 | R33.2 v49.78,79.5 | C91.2 v44.96,82.55 | R25.1 v43.69,81.15 | U18.3 v56.52,118.11
  Top 0.254: R39.1 v25.91,113.54 | R36.1 v26.04,126.75 | C84.2 v27.18,89.15 | C83.2 v27.18,85.6 | C121.2 v23.24,45.59 | U16.2 v27.43,47.37 | R31.1 v74.17,45.34 | C123.2 v67.56,40.51 | C7.2 v67.56,38.73
  Top 0.279: R1.1 40.62,63.53 v41.27,62.87 | U17.4 60.69,51.45 v60.71,51.44 | U1.P$54 26.65,65 v26.8,65.15
  Top 0.305: U8.P$7 63.8,79.9 U8.P$29 | U9.P$7 63.67,92.6 U9.P$29 | U2.P$8 v68.71,35.94 | U2.P$3 v71.5,35.94 | U12.4 v42.29,106.36 | U12.1 v47.37,104.46 | C78.2 v20.95,67.44
  Top 0.406: C107.2 v29.72,118.11 | C113.2 v29.97,105.41 | C112.2 v29.97,104.27 | C106.2 v29.72,119.25 | C108.2 v29.72,116.97 | C114.2 v29.97,106.55 | C105.2 v29.84,130.18 | C104.2 v29.84,131.32 | C103.2 v29.84,132.46 | C97.2 v53.85,82.42 | C96.2 v53.85,81.28 | C95.2 v53.85,80.14 | C98.2 v44.32,90.42 | C99.2 v44.32,89.28 | C100.2 v44.32,88.14 | C109.2 v30.1,117.47 | C110.2 v30.1,118.62 | C111.2 v30.1,119.76 | C120.2 v33.91,50.67 | C119.2 v35.18,50.67 | C118.2 v36.7,51.31 | X3.P$2 32.35,51.02 v32.64,51.31 | X2.P$2 32.35,46.32 v32.64,46.61 | C117.2 33.91,45.72 v34.8,46.61 | C116.2 v35.18,45.85 | C115.2 v36.7,46.48
  Top 1.27: D2.A v66.55,24.13 | D9.A v71.12,6.86
  Top 1.524: C6.- v77.47,54.74
  Route2 0.152: 46.35,39.5 46.23,39.62
  Route2 0.254: 24.26,90.81 24.38,90.93
  Route2 0.279: 20.16,72.93 20.19,72.9
  Bottom 0.279: C71.2 v29.08,71.37 | C68.2 v30.23,71.37 | C67.2 v31.37,71.37 | C66.2 v32.51,71.37 | C72.2 v34.29,71.37 | C73.2 v23.5,64.9 | C64.2 v23.5,62.48 | v35.56,56.9 34.95,56.9 C76.2 | C70.2 v38.61,67.06 | v38.48,65.66 37.85,65.02 C63.2 | v28.19,56.11 28.32,56.26 C75.2 | v38.61,61.59 38.31,61.21 C62.2 | C74.2 v38.61,62.48 | C61.2 v31.62,56.13 30.86,56.13 30.48,56.52 C65.2 | C60.2 v23.5,63.63 | C69.2 23.75,66.7 v23.75,66.8
  other vias: 54.48,19.81 53.72,20.45 55.37,19.81 52.83,20.45 51.05,20.45 50.16,20.45 51.94,20.45 53.34,22.61 53.34,23.5 52.58,22.1 27.56,23.5 27.56,22.61 26.04,20.45 25.15,20.45 24.26,20.45 26.92,20.45 27.81,20.45 28.57,19.81 29.46,19.81 17.02,86.74 50.29,54.74 49.66,54.74 50.93,54.74 51.56,54.74 49.02,54.74 49.02,54.1 49.66,54.1 50.29,54.1 50.93,54.1 51.56,54.1 52.2,54.1 48.39,54.1 48.39,53.47 49.02,53.47 49.66,53.47 50.29,53.47 50.93,53.47 51.56,53.47 52.2,53.47 28.19,2.67 28.96,2.67 29.72,2.67 36.07,2.67 36.83,2.67 37.59,2.67 43.94,2.67 44.7,2.67 45.47,2.67 51.82,2.67 52.58,2.67 53.34,2.67 59.69,2.67 60.45,2.67 61.21,2.67 26.8,22.1 25.91,22.1 30.48,2.67 27.43,2.67 31.24,2.67 58.93,2.67 61.98,2.67 62.74,2.67 63.5,2.67 51.05,2.67 54.1,2.67 54.86,2.67 55.63,2.67 43.18,2.67 46.23,2.67 46.99,2.67 47.75,2.67 35.31,2.67 38.35,2.67 39.12,2.67 39.88,2.67 32,2.67 51.69,22.1
  pour Top (rank 3, no thermals): 61.59,25.02 61.59,18.41 49.53,18.41 49.53,25.02
  pour Top (rank 2, no thermals): 64.64,77.85 63.75,77.85 63.75,80.65 66.29,80.65 67.06,80.01 71.37,80.01 71.37,85.09 72.9,85.09 72.9,73.41 71.37,73.41 71.37,78.49 67.06,78.49 66.55,77.98 64.77,77.98
  pour Top (rank 3, no thermals): 35.69,25.02 35.69,18.41 23.62,18.41 23.62,25.02
  pour Top (no thermals): 65.02,75.18 65.02,74.68 64.9,74.55 61.85,74.55 61.21,75.18 61.21,83.19 61.98,83.95 63.37,83.95 63.5,83.82 63.5,83.31 63.37,83.19 62.23,83.19 61.98,82.93 61.98,80.26 62.1,80.14 63.63,80.14 63.63,79.63 62.1,79.63 61.98,79.5 61.98,75.56 62.23,75.31 64.9,75.31
  pour Top (rank 2, no thermals): 64.52,90.55 63.63,90.55 63.63,93.34 66.17,93.34 66.93,92.71 71.25,92.71 71.25,97.79 72.77,97.79 72.77,86.11 71.25,86.11 71.25,91.19 66.93,91.19 66.42,90.68 64.64,90.68
  pour Top (no thermals): 64.9,87.88 64.9,87.38 64.77,87.25 61.72,87.25 61.09,87.88 61.09,95.89 61.85,96.65 63.25,96.65 63.37,96.52 63.37,96.01 63.25,95.89 62.1,95.89 61.85,95.63 61.85,92.96 61.98,92.84 63.5,92.84 63.5,92.33 61.98,92.33 61.85,92.2 61.85,88.27 62.1,88.01 64.77,88.01
  pour Top (no thermals): 50.04,37.34 50.04,35.69 49.15,35.69 49.15,37.34 48.9,37.59 45.47,37.59 45.21,37.34 45.21,35.05 44.7,35.05 44.7,37.47 45.34,38.1 49.28,38.1
  pour Top (rank 2, no thermals): 26.67,30.61 25.78,30.61 25.78,33.4 27.81,33.4 28.96,32.26 32.89,32.26 32.89,36.32 34.67,36.32 34.67,26.8 32.89,26.8 32.89,31.75 28.96,31.75 27.94,30.73 26.8,30.73
  pour Top (no thermals): 26.42,27.43 23.75,27.43 23.24,27.94 23.24,31.75 23.75,32.26 25.91,32.26 25.91,33.02 25.78,33.15 24.26,33.15 24.26,33.53 26.04,33.53 26.04,29.08 25.65,29.08 25.65,30.23 25.4,30.48 24.26,30.48 24.26,30.86 25.78,30.86 25.78,31.75 24,31.75 23.75,31.5 23.75,28.19 24,27.94 26.42,27.94
  pour Top (no thermals): 10.03,27.43 7.37,27.43 6.86,27.94 6.86,31.75 7.37,32.26 9.53,32.26 9.53,33.02 9.4,33.15 7.87,33.15 7.87,33.53 9.65,33.53 9.65,29.08 9.27,29.08 9.27,30.23 9.02,30.48 7.87,30.48 7.87,30.86 9.4,30.86 9.4,31.75 7.62,31.75 7.37,31.5 7.37,28.19 7.62,27.94 10.03,27.94
  pour Top (rank 2, no thermals): 10.29,30.61 9.4,30.61 9.4,33.4 11.43,33.4 12.57,32.26 16.51,32.26 16.51,35.81 18.29,35.81 18.29,26.8 16.51,26.8 16.51,31.75 12.57,31.75 11.56,30.73 10.41,30.73
  pour Top (no thermals): 9.27,91.57 9.27,80.14 25.02,80.14 24.89,91.57
  pour Route2 (no thermals): 6.35,0 87,0 arc90 93.34,6.35 93.34,128.27 arc90 87,134.62 6.35,134.62 arc90 0,128.27 0,6.35 arc90
  pour Top (no thermals): 53.72,57.02 46.86,57.02 46.48,56.64 46.48,51.56 46.99,51.05 53.59,51.05 54.1,51.56 54.1,56.64
  pour Top (rank 2, no thermals): 25.4,6.98 63.88,6.98 63.88,2.16 25.4,2.16
  pour Top (no thermals): 48.01,35.56 50.55,35.56 50.55,33.53 49.53,32.51 49.53,28.83 55.63,28.83 55.63,27.18 45.47,27.18 45.47,28.83 49.02,28.83 49.02,32.51 48.01,33.53
AUDIO_ENABLE  (via drill 0.3)
  Top 0.152: U11.P$17 8.55,85.77 7.49,84.71 7.49,80.01 10.67,76.84 24.51,76.84 v25.02,76.33 | U1.P$19 39.16,61 v39.5,61.34
  Bottom 0.152: v25.02,76.33 25.15,76.2 25.15,70.87 28.45,67.56 29.72,66.29 33.15,66.29 35.56,63.88 38.86,63.88 39.5,63.25 v39.5,61.34
AUDIO_STREAMING  (via drill 0.3)
  Top 0.152: v43.43,58.67 42.86,59.25 42.1,60 U1.P$17 | v58.42,57.79 58.42,55.25 59.56,54.1 59.94,54.1 60.2,53.85 U17.3
  Bottom 0.152: v43.43,58.67 57.53,58.67 v58.42,57.79
AVDD  (via drill 0.3, 0.51, 0.61)
  Top 0.152: v68.71,58.04 72.39,58.04 72.77,57.66 72.77,52.07 70.99,50.29 68.58,50.29 67.82,49.53 v67.82,42.8 | v65.02,58.04 64.39,58.04 64.01,57.66 D8.1 | 21.58,88.89 22.06,88.89 C89.1 | U7.P$1 U7.P$2 11.45,36.24 C34.1 | TP5.S 15.49,40.13
  Top 0.254: C90.1 21.58,88.89 21.06,88.37 U11.P$8
  Top 0.61: v12.57,46.74 12.57,45.72 15.49,42.8 15.49,40.13 15.49,35.69 | v25.78,88.9 C90.1
  Route15 0.61: v12.57,46.74 12.57,86.11 15.37,88.9 v25.78,88.9
  Bottom 0.152: v15.62,34.93 34.8,34.93 42.67,27.05 59.18,27.05 65.28,33.15 65.28,40.26 v67.82,42.8 | v68.71,58.04 v65.02,58.04
  pour Top (no thermals): 11.43,33.78 11.43,34.8 13.72,34.8 14.73,35.81 16.13,35.81 16.13,32.64 12.57,32.64
CLK
  Top 0.152: TP1.S 18.29,65.91 20.36,63.84 X1.P$3 20.41,63 U1.P$58
DVDD  (via drill 0.3, 0.38)
  Top 0.152: R2.1 26.26,37.06 26.42,37.21 28.19,37.21 28.42,36.98 C9.1 28.42,35.91 27.83,35.32 U4.P$2 | R18.2 v48.8,50.45 | R13.2 v49.15,46.1 52.7,46.1 v57.15,41.66 | 24.1,47.34 v24.13,47.37 | v51.73,50.45 51.73,49.59 R17.2 | U1.P$13 33.37,55.36 R16.2 | R45.2 26.7,73.94 v26.67,73.91 | TP6.S v30.86,40.64
  Top 0.203: X3.P$1 X3.P$4 | X2.P$1 X2.P$4 | C77.2 19.1,59.94 18.51,60.54 X1.P$1 X1.P$4 18.51,64.23 v18.54,64.26 | v70.61,57.53 D5.1 | U17.8 59.19,56.88 v59.18,56.9 | v66.55,52.45 66.55,44.45 v67.06,43.94 | v21.73,64.26 24,64.26 24.25,64.5 U1.P$55
  Top 0.254: U4.P$1 U4.P$2 | C87.1 12.42,83.03 13.2,83.82 U11.P$20 | C88.1 13.58,82.67 14.22,83.31 14.22,83.32 U11.P$20 | C86.1 20.69,82.43 19.81,83.31 U11.P$1 | C85.1 21.59,83.06 20.83,83.82 U11.P$1 | U16.5 v24.13,47.37 | C121.1 24.1,47.34 | U11.P$1 v18.54,83.82 | U11.P$20 v15.49,83.82
  Top 0.279: U1.P$55 27.55,64.5 v27.56,64.52 | U1.P$44 29.36,67.59 v29.34,67.56 | U1.P$34 34.37,68.15 v34.29,68.07 | U1.P$3 v28.36,60.58 | U1.P$22 34.44,62.5 v34.42,62.48 | U1.P$13 33.37,59.27 33.78,59.69 33.55,59.92 v33.55,60.17
  Top 0.305: v30.86,40.64 32.13,40.64 32.77,41.28 v33.78,41.28
  Top 0.406: v41.66,46.74 40.26,46.74 | v33.78,42.67 33.02,42.67 32.35,43.34 X2.P$1 32.35,43.91 32.64,44.2 33.81,44.2 C117.1 C116.1 35.28,44.1 35.43,43.94 36.54,43.94 C115.1 | v33.78,47.37 33.02,47.37 32.35,48.04 X3.P$1 32.35,48.6 32.64,48.9 33.88,48.9 C120.1 C119.1 35.28,48.92 35.43,48.77 36.54,48.77 C118.1 | J5.2 51.29,50.89 v51.73,50.45
  Top 0.508: v33.78,41.28 v33.78,42.67
  Top 0.61: v33.78,41.28 36.07,38.99
  Top 1.016: 36.77,58.1 34.65,60.22 v34.59,60.22
  Top 1.524: 36.77,58.1 40.26,54.61 40.26,46.74 40.26,43.18 36.07,38.99 31.84,34.76 C19.1
  Route15 0.203: v18.54,64.26 v21.73,64.26
  Route15 0.61: v33.78,47.37 v33.78,42.67 | v15.49,83.82 v18.54,83.82 23.5,83.82 26.67,80.65 v26.67,79.25 v26.67,73.91 26.67,69.65 28.76,67.56 v29.34,67.56
  Bottom 0.152: 68.83,49.4 68.83,45.72 v67.06,43.94 | v57.15,41.66 64.77,41.66 66.99,43.88
  Bottom 0.203: 68.83,49.4 68.83,50.04 69.85,51.05 69.85,56.77 v70.61,57.53 | v59.18,56.9 58.8,56.52 58.8,53.09 59.44,52.45 v66.55,52.45 | v67.06,43.94 66.99,43.88 | 24.13,43.81 27.3,40.64 v30.86,40.64
  Bottom 0.254: v24.13,47.37 24.13,43.81 | v51.73,50.45 v48.8,50.45
  Bottom 0.279: C74.1 v34.42,62.48 | C75.1 28.36,58.05 v28.36,60.58 | C73.1 25.91,64.9 26.29,64.52 v27.56,64.52 | C71.1 29.34,69.24 v29.34,67.56 | C72.1 v34.29,68.07 | C76.1 34.06,58.8 v34.06,59.67
  Bottom 0.305: JP1.8 24.38,97.54 28.83,93.09 28.83,81.41 v26.67,79.25
  Bottom 0.406: v41.66,46.74 42.29,46.1 v49.15,46.1 51.73,48.68 v51.73,50.45
  other vias: 34.11,60.71 34.62,61.24 35.13,60.76 34.77,59.54 35.31,60.1
  pour Top (no thermals): 27.81,33.91 27.81,35.05 29.08,35.05 29.46,35.43 32.51,35.43 32.51,32.64 28.92,32.64 28.92,32.8
  pour Route15 (no thermals): 33.27,68.33 31.88,66.93 30.86,66.93 30.48,67.31 30.35,67.44 29.97,67.82 28.7,67.82 28.66,67.86 27.69,66.89 27.69,65.02 27.43,64.77 27.43,64.26 27.69,64.01 27.69,60.96 28.32,60.33 33.02,60.33 33.91,59.44 35.43,59.44 35.43,60.71 34.54,61.59 34.54,68.33
  pour Top: 33.29,60.08 34.67,61.47 35.18,60.96 35.18,60.33 34.54,59.69 33.68,59.69
  pour Top: 33.15,60.2 34.61,61.66 35.56,60.71 35.56,59.69 35.05,59.18 34.16,59.18
  pour Route15: 26.67,74.55 26.42,74.55 26.04,74.17 26.04,73.66 26.54,73.15 26.67,73.15 26.8,73.15 27.3,73.66 27.3,74.17 26.92,74.55
  pour Route15: 26.67,79.76 26.42,79.76 26.16,79.5 26.16,78.99 26.42,78.74 26.92,78.74 27.18,78.99 27.18,79.5 26.92,79.76
GAIN_LEFT
  Top 0.203: R33.1 49.53,82.46 U13.P$6 49.53,86.11 50.55,87.12 54.07,87.12 R26.1 54.68,87.09 C92.1
GAIN_RIGHT
  Top 0.203: R30.1 55.18,89.44 C94.1 54.07,89.41 51.18,89.41 50.8,89.79 U13.P$2 50.8,92.93 R34.2
I2C_SCL  (via drill 0.3)
  Top 0.152: J5.4 49.29,50.91 49.76,50.45 R18.1 49.76,48.23 49.4,47.88 45.85,47.88 44.96,48.77 44.96,54.74 43.31,56.39 v41.66,56.39 | U1.P$14 33.87,58.07 33.91,58.04 33.91,55.63 v35.56,53.98
  Bottom 0.152: v41.66,56.39 39.24,53.98 v35.56,53.98 34.29,53.98 33.91,54.36 32.51,55.75 32.51,57.4 32.51,59.56 31.75,60.33 29.72,60.33 28.45,61.59 28.45,65.66 23.24,70.87 23.24,77.22 24,77.98 24,91.19 22.73,92.46 JP1.10
I2C_SDA  (via drill 0.3)
  Top 0.152: J5.3 50.29,51.44 50.8,50.93 50.8,49.56 R17.1 50.83,48.29 49.91,47.37 45.72,47.37 44.45,48.64 44.45,54.48 43.69,55.25 41.66,55.25 41.02,55.88 41.02,56.64 v41.66,57.28 | U1.P$16 34.87,56.7 v36.83,54.74
  Bottom 0.152: v41.66,57.28 39.12,54.74 v36.83,54.74 34.8,54.74 33.02,56.52 33.02,57.53 33.02,59.82 32,60.83 29.97,60.83 28.96,61.85 28.96,66.17 24,71.12 24,76.84 24.77,77.6 24.77,93.09 22.86,95 JP1.9
I2S_BCLK
  Top 0.152: U11.P$13 14.19,88.39 7.75,88.39 5.97,86.61 5.97,79.25 9.27,75.95 9.27,58.04 12.45,54.86 22.1,54.86 23.5,56.26 27.43,56.26 27.86,56.69 U1.P$2
I2S_DATA
  Top 0.152: U11.P$14 14.18,87.76 7.87,87.76 6.48,86.36 6.48,79.5 9.78,76.2 9.78,58.29 12.7,55.37 21.97,55.37 23.24,56.64 27.18,56.64 27.36,56.83 U1.P$1
I2S_LRCLK
  Top 0.152: U11.P$15 14.16,87.12 8,87.12 6.99,86.11 6.99,79.76 10.29,76.45 10.29,58.55 12.95,55.88 20.7,55.88 24.82,60 U1.P$64
I2S_MCLK
  Top 0.152: R21.2 7.62,89.03 5.46,86.87 5.46,78.99 8.76,75.69 8.76,57.79 12.19,54.36 20.7,54.36 22.23,52.83 22.23,48.9 22.8,48.32 U16.4 25.7,51.74 28.86,54.9 U1.P$4
I2S_MCLK_48
  Top 0.152: R42.2 29.35,50.2 X3.P$3
I2S_MCLK_441
  Top 0.152: R41.2 29.31,44.68 30.1,45.47 30.86,45.47 X2.P$3
I2S_MCLK_SEL  (via drill 0.3)
  Top 0.152: U16.6 25.7,46.36 | 25.7,46.36 25.7,44.6 R43.2 | v25.15,58.17 28.19,61.21 28.19,66.55 28.57,66.93 29.84,66.93 30.23,67.31 30.23,68.58 30.36,68.72 U1.P$42 | v25.15,54.74 25.15,51.95 v23.37,50.17 | v27.05,46.36 25.7,46.36
  Bottom 0.152: v25.15,58.17 25.15,54.75 v25.15,54.74 | v23.37,50.17 27.05,46.48 v27.05,46.36
JACK_DETECT
  Top 0.152: U1.P$51 26.37,66.5 26.92,67.06 26.92,67.56 24.64,69.85 24.64,73.76 C122.1 R47.2
JACK_ENABLE  (via drill 0.3)
  Top 0.152: U12.5 v42.29,105.41 | v42.16,96.27 30.73,96.27 v30.1,95.63 | v33.53,75.69 33.53,70.99 33.87,70.66 U1.P$35
  Bottom 0.152: v42.29,105.41 42.29,96.39 v42.16,96.27 | v30.1,95.63 30.1,79.12 v33.53,75.69
LINE_OUT_LEFT  (via drill 0.3)
  Top 0.203: v68.07,101.47 78.51,101.47 U19.2 79.87,101.49 80.9,100.46 80.9,87.88 82.42,86.36 85.34,86.36 J4.L_TIP
  Bottom 0.203: RL1.P$2 33.78,90.68 43.43,90.68 43.94,91.19 44.7,91.19 45.21,90.68 57.28,90.68 v68.07,101.47
LINE_OUT_RIGHT  (via drill 0.3)
  Top 0.203: v68.07,100.2 78.51,100.2 U19.1 78.63,100.19 79.63,99.19 79.63,77.07 J4.R_TIP
  Bottom 0.203: RL1.P$9 41.53,89.41 43.94,87 48.77,87 51.56,89.79 57.66,89.79 v68.07,100.2
LINE_OUT_SEL  (via drill 0.3)
  Top 0.152: v43.56,59.44 42.49,60.5 U1.P$18 | U17.6 v60.2,58.67 59.05,59.82 59.05,93.09 50.16,101.98 50.16,103.76 48.51,105.41 U12.2
  Bottom 0.152: v43.56,59.44 59.44,59.44 v60.2,58.67
LINK_DOWN0  (via drill 0.3)
  Top 0.152: U1.P$6 29.86,54 v29.34,53.47 | JP2.14 3.3,58.8 6.6,58.8 7.24,58.17 7.24,55.63 v8.89,53.98
  Bottom 0.152: v29.34,53.47 28.7,54.1 24,54.1 21.46,56.64 11.56,56.64 v8.89,53.98
LINK_DOWN1  (via drill 0.3)
  Top 0.152: U1.P$5 29.36,54.26 v28.57,53.47 | v10.03,53.09 10.03,55.63 8.26,57.4 8.26,62.99 7.37,63.88 3.3,63.88 JP2.18
  Bottom 0.152: v28.57,53.47 24.13,53.47 21.34,56.26 11.94,56.26 10.03,54.36 v10.03,53.09
LINK_UP0  (via drill 0.3)
  Top 0.152: v27.56,52.45 R19.2 | JP2.10 3.3,53.72 7.24,53.72 v9.78,51.18
  Bottom 0.152: v27.56,52.45 24.64,52.45 23.62,53.47 21.21,55.88 12.32,55.88 10.79,54.36 10.79,52.2 v9.78,51.18
LINK_UP1  (via drill 0.3)
  Top 0.152: v27.56,51.31 R20.2
  Bottom 0.152: v27.56,51.31 25.27,51.31 23.24,53.34 21.08,55.5 12.57,55.5 11.3,54.23 11.3,49.78 10.16,48.64 3.3,48.64 JP2.6
N$1
  Top 0.254: C81.1 18.83,82.89 18.67,83.06 18.03,83.06 17.78,83.31 17.78,84.2 18.03,84.45 19.81,84.45 U11.P$2
N$2
  Top 0.254: C81.2 17.23,84.92 18.07,85.77 U11.P$4
N$3
  Top 0.279: U11.P$5 21.15,86.42 21.43,86.14 C82.1
N$4
  Top 0.254: U11.P$18 11.99,85.12 C79.1 11.91,85.09 10.54,85.09 C80.1
N$5
  Top 0.203: U11.P$6 26.73,87.07 27.05,86.74 R22.1
N$6
  Top 0.203: U11.P$7 26.76,87.72 27.05,88.01 R23.1
N$7
  Top 1.524: D2.C 73.09,18.61 F1.P$1
  pour Top (no thermals): 81.41,16.26 82.17,17.02 82.17,18.54 81.41,19.3 74.8,19.3 74.3,19.81 74.3,21.08 73.79,21.59 72.52,21.59 72.01,21.08 72.01,16 72.26,15.75 74.3,15.75 74.8,16.26
N$8
  pour Top (rank 2, no thermals): 68.83,11.56 64.9,11.56 64.9,20.96 65.28,21.34 68.45,21.34 68.83,20.96
  pour Top (no thermals): 71.75,14.86 68.71,14.86 68.71,12.57 71.88,12.57 71.88,14.86
N$9
  Top 0.152: U4.P$13 27.18,27.71 C20.1
N$10
  Top 0.203: D8.2 R53.2
N$11
  Top 0.152: C9.2 27.46,35.59 27.18,35.31 U4.P$3
N$12
  Top 0.152: C57.1 65.63,89.5 U9.P$14
N$13
  Top 0.152: U8.P$14 65.8,74.97
  Top 0.254: 65.8,74.97 C49.1
N$14
  Top 0.152: U8.P$3 65.15,82.55 65.41,82.8 R9.1 | R10.2 65.31,83.57 R9.1 | C42.2 65.5,83.57 R9.1
N$15  (via drill 0.3)
  Top 0.305: U12.6 41.21,104.46 v41.15,104.39
  Bottom 0.305: RL1.P$10 40.13,103.38 v41.15,104.39
N$16
  Top 0.152: U9.P$3 65.02,95.25 65.28,95.5 R11.1 | R12.2 65.18,96.27 R11.1 | C50.2 65.38,96.27 R11.1
N$17
  Top 0.203: U13.P$3 49.53,92.93 R28.2 49.31,92.96 R29.2 47.85,93.03 C93.1
N$18
  Top 0.203: R25.2 46.71,81.47 C91.1 47.79,82.55 R24.2 48.26,82.33 U13.P$5
N$19
  Top 0.203: U14.P$3 30.61,121.03 30.23,120.65 26.92,120.65 26.04,121.54 R36.2 | U14.P$5 31.88,126.62 30.23,124.97 26.06,124.97 R36.2 | R36.2 26.01,124.97 20.7,124.97 18.76,123.02 C101.P$2
N$20
  Top 0.203: U15.P$3 30.48,107.82 30.1,107.44 26.67,107.44 25.91,108.2 R39.2 25.94,111.76 30.1,111.76 31.75,113.41 U15.P$5 | 25.88,111.76 20.41,111.76 C102.P$2
  Top 0.254: 25.88,111.76 R39.2
N$21
  Top 0.254: 34.52,123.7 R35.1
  Top 0.305: U14.P$1 U14.P$2 29.34,123.06 29.97,123.7 34.52,123.7
N$22
  Top 0.254: 34.54,126.47 R37.1
  Top 0.305: U14.P$7 U14.P$6 30.61,129.16 31.24,129.79 33.91,129.79 34.54,129.16 34.54,126.47
N$23
  Top 0.203: RL1.P$7 42.42,84.33 43.05,84.96 43.05,94.49 43.81,95.25 48.9,95.25 49.4,94.74 R28.1
N$24
  Top 0.254: 34.39,110.49 R38.1
  Top 0.305: 34.39,110.49 29.84,110.49 29.21,109.86 U15.P$2 U15.P$1
N$25
  Top 0.254: 34.54,113.18 R40.1
  Top 0.305: 34.54,113.18 34.54,115.95 33.91,116.59 31.11,116.59 30.48,115.95 U15.P$6 U15.P$7
N$26
  Top 0.203: RL1.P$4 37.85,84.33 39.12,83.06 42.42,83.06 43.05,82.42 43.05,80.26 43.69,79.63 47.16,79.63 R24.1
N$27
  Top 0.152: R46.2 48.8,124.11 47.88,123.19 RL2.P$3
  Top 0.305: RL2.P$3 50.78,119.14 59.22,119.14 U18.2 68.98,118.76 J3.T
N$28  (via drill 3.81 pad 6.99)
  other vias: 6.35,128.91
N$29
  Top 0.305: J3.R 77.85,121.02 77.85,117.47 75.44,115.06 71.37,115.06 68.98,117.46 U18.1 59.23,117.09 50.55,117.09 RL2.P$8
N$30  (via drill 3.81 pad 6.99)
  other vias: 87,128.91
N$31  (via drill 3.81 pad 6.99)
  other vias: 87,60.96
N$32  (via drill 3.81 pad 6.99)
  other vias: 87,5.72
N$34
  Top 0.152: U1.P$7 30.36,53.48 29.34,52.45 R19.1
N$35
  Top 0.152: U1.P$8 30.86,52.84 29.34,51.31 R20.1
N$36
  Top 0.152: U1.P$11 32.37,55.32 R16.1
N$37
  Top 0.279: U1.P$24 39.45,63.5 R1.2
N$38
  Top 0.203: D3.2 R48.2
N$39
  Top 0.203: D5.2 R50.2
N$40
  Top 0.152: 68.96,56.39 68.2,55.63 61.85,55.63 60.71,54.48 59.94,54.48 59.69,54.74 U17.7
  Top 0.203: D4.1 68.96,56.39 | U17.7
N$41
  Top 0.203: D4.2 R49.2
N$42
  Top 0.152: D6.1 67.31,57.4 65.91,58.8 62.61,58.8 60.71,56.9 60.71,55.66
  Top 0.203: 60.71,55.66 U17.5
N$43
  Top 0.203: D6.2 R51.2
N$44  (via drill 0.3)
  Top 0.152: D7.1 v65.66,57.53 | v59.69,53.47 U17.2
  Top 0.203: U17.2
  Bottom 0.152: v65.66,57.53 63.75,57.53 v59.69,53.47
N$45
  Top 0.203: D7.2 R52.2
N$46  (via drill 0.3)
  Top 0.152: v17.4,58.67 20.7,58.67 24.03,62 U1.P$60
  Bottom 0.152: v17.4,58.67 10.16,58.67 7.75,56.26 3.94,56.26 3.3,55.63 3.3,53.72 JP2.7
N$47  (via drill 0.3)
  Top 0.152: v18.03,58.17 20.83,58.17 24.17,61.5 U1.P$61
  Bottom 0.152: v18.03,58.17 10.54,58.17 7.37,54.99 JP2.9
N$48  (via drill 0.3)
  Top 0.152: v18.67,57.66 20.95,57.66 24.3,61 U1.P$62
  Bottom 0.152: v18.67,57.66 10.92,57.66 7.49,54.23 7.49,50.67 6.73,49.91 JP2.5
N$49  (via drill 0.3)
  Top 0.152: v19.3,57.15 21.08,57.15 24.44,60.5 U1.P$63 | v9.02,54.86 7.75,56.13 7.75,59.18 6.86,60.07 JP2.13
  Bottom 0.152: v19.3,57.15 11.3,57.15 v9.02,54.86
N$50  (via drill 0.41)
  other vias: 30.48,18.67 30.48,17.91 31.24,17.91 31.24,18.67 32.38,21.72 22.48,19.43 23.24,19.05 23.24,18.16 23.24,17.27 22.48,16.76 22.48,17.65 22.48,18.54
  pour Top (no thermals): 31.37,19.05 30.35,19.05 30.1,18.8 30.1,17.78 30.35,17.53 31.37,17.53 31.75,17.91 32.89,17.91 32.89,18.67 31.75,18.67
  pour Top (no thermals): 34.04,22.1 34.04,21.34 33.27,21.34 33.15,21.46 32.26,21.46 32.13,21.59 32.13,21.84 32.26,21.97 33.15,21.97 33.27,22.1
  pour Top (no thermals): 21.08,19.81 22.99,19.81 23.62,19.18 23.62,17.02 22.99,16.38 21.08,16.38
  pour Route15 (no thermals): 22.99,19.81 21.84,19.81 21.84,16.38 22.99,16.38 24.26,17.65 29.97,17.65 30.23,17.4 32.51,17.4 32.77,17.65 32.77,21.97 32,21.97 32,19.43 31.75,19.18 30.27,19.18 30.01,18.92 23.88,18.92
N$51
  Top 0.152: R41.1 28.35,46.37 U16.1
N$52
  Top 0.254: U3.6 35.13,20.27 35.32,20.46 35.34,20.46 C8.1
N$53
  Top 0.152: R3.1 R4.2 36.2,23.24 36.58,22.86 36.58,17.78 36.13,17.34 U3.4
N$54  (via drill 0.41)
  other vias: 56.39,18.67 57.15,18.67 56.39,17.91 57.15,17.91 58.29,21.72 48.39,16.76 49.15,17.27 48.39,17.65 49.15,18.16 49.15,19.05 48.39,18.54 48.39,19.43
  pour Top (no thermals): 57.28,19.05 56.26,19.05 56.01,18.8 56.01,17.78 56.26,17.53 57.28,17.53 57.66,17.91 58.8,17.91 58.8,18.67 57.66,18.67
  pour Top (no thermals): 59.94,22.1 59.94,21.34 59.18,21.34 59.05,21.46 58.17,21.46 58.04,21.59 58.04,21.84 58.17,21.97 59.05,21.97 59.18,22.1
  pour Route15 (no thermals): 48.9,19.81 47.88,19.81 47.88,16.38 48.9,16.38 50.16,17.65 55.88,17.65 56.13,17.4 58.55,17.4 58.67,17.53 58.67,21.97 57.91,21.97 57.91,19.43 57.66,19.18 56.13,19.18 55.88,18.92 49.78,18.92
  pour Top (no thermals): 46.99,19.81 48.9,19.81 49.53,19.18 49.53,17.02 48.9,16.38 46.99,16.38
N$55
  Top 0.254: U5.6 61.04,20.15 61.34,20.45 61.34,21.71 C21.1
N$56
  Top 0.152: R6.1 R7.2 62.36,23.24 62.61,22.99 62.61,17.65 62.3,17.34 U5.4
N$57
  Top 0.152: C33.1 46.85,34.32 U6.P$13
N$58
  Top 0.152: U6.P$3 53.49,34.29 C22.2
N$59
  Top 0.152: R42.1 28.35,48.37 U16.3
N$60
  Top 0.152: U7.P$13 10.79,27.71 C41.1
N$61
  Top 0.152: U7.P$3 10.79,36.1 C34.2
N$62  (via drill 3.81 pad 6.99)
  other vias: 6.35,5.72
N$63
  Top 0.152: U11.P$12 10.14,89.02 R21.1
N$64
  Top 0.305: U12.3 48.58,106.36 52.96,110.74 RL2.P$10
N$65  (via drill 3.81 pad 6.99)
  other vias: 87,33.66
N$69  (via drill 3.81 pad 6.99)
  other vias: 87,100.97
N$79  (via drill 0.3)
  Top 0.152: R47.1 27.79,74.93 R45.1 27.84,74.93 31.75,74.93 33.15,76.33 33.91,76.33 35.31,74.93 v37.97,74.93
  Bottom 0.152: J3.TN 71.37,107.95 74.68,104.65 74.68,77.72 67.82,70.87 60.07,70.87 56.01,74.93 v37.97,74.93
N$231
  Top 0.152: R31.2 76.07,45.34
  Top 0.203: C7.1 70.4,37.03 U2.P$5 U2.P$6
  Top 0.254: J2.P$1 77.45,46.72 76.07,45.34 | R27.1 70.58,40.7 C123.1 C7.1 70.4,38.61 72.9,38.61 76.05,41.76 R31.2
OUT_LEFT
  Top 0.305: RL2.P$4 43.81,123.57 R35.2 R37.2
OUT_RIGHT
  Top 0.305: RL2.P$7 44.07,113.16 R40.2 R38.2
PG_DVDD  (via drill 0.3)
  Top 0.152: 25.27,36.29 25.27,36.42 v25.27,38.86 | 25.27,36.29 R2.2 | U4.P$4 26.53,35.19 26.16,35.56 25.65,35.56 25.27,35.94 25.27,36.29 | U6.P$14 44.34,33.64 v43.56,34.42
  Bottom 0.152: v43.56,34.42 36.58,34.42 32.13,38.86 v25.27,38.86
PLL_AVDD
  Top 0.152: C78.1 19.91,65.56 16.51,68.96 TP4.S
  Top 0.279: U1.P$53 22.15,65.5 R14.1 C78.1
PREAMP_LEFT
  Top 0.203: U13.P$7 50.8,85.98 51.18,86.36 53.81,86.36 R26.2 54.68,86.13 C92.2 56.03,86.13 56.52,86.61 56.52,92.58 48.51,100.58 16.13,100.58 6.48,110.24 JP1.3
PREAMP_RIGHT
  Top 0.203: U13.P$1 52.35,90.4 C94.2 55.18,90.4 R30.2 55.5,92.33 49.78,98.04 16.64,98.04 6.99,107.7 JP1.4
RAW_LEFT
  Top 0.203: C83.1 R22.2 32.38,86.74 RL1.P$3
RAW_RIGHT
  Top 0.203: C84.1 R23.2 38.99,88.01 RL1.P$8
USB_CONNECTED  (via drill 0.3)
  Top 0.152: v59.18,51.05 U17.1 | v34.8,55.63 34.37,56.06 U1.P$15
  Bottom 0.152: v59.18,51.05 57.91,52.32 57.91,56.9 56.77,58.04 41.53,58.04 39.12,55.63 v34.8,55.63
USB_D_N
  Top 0.279: J2.P$2 79.68,44.03 80.53,43.18 80.53,37.69 79.02,36.18 72.26,36.18 71.87,36.58 71.12,36.58 | 71.12,36.58 70.98,36.44 U2.P$4 U2.P$7 69.34,36.45 69.22,36.58 68.34,36.58 67.94,36.18 65.76,36.18 56.5,45.44 56.5,57.63 54.2,59.93 46.07,59.93 41.63,64.38 41.27,64.77 40.95,65.1 40.89,65.1 38.98,65.1 38.38,64.5 U1.P$26 | 71.12,36.58 | 71.12,36.58
USB_D_P
  Top 0.279: J2.P$3 81.68,43.85 81.01,43.18 81.01,37.49 79.22,35.7 72.26,35.7 71.87,35.31 71.12,35.31 70.98,35.44 U2.P$2 U2.P$9 69.34,35.43 69.22,35.31 68.33,35.31 67.94,35.7 65.56,35.7 56.02,45.24 56.02,57.43 54,59.45 45.87,59.45 40.76,64.57 39.15,64.57 38.95,64.37 38.59,64 U1.P$25
USB_VBUS  (via drill 0.3)
  Top 0.152: D3.1 v62.36,57.53 | R27.2 69.6,42.06 v69.6,44.2 69.62,44.17 C124.1 | U1.P$23 38.85,63 39.62,62.23 v40.39,62.23
  Bottom 0.152: v69.6,44.2 69.6,49.91 69.98,50.29 71.25,50.29 72.77,51.82 72.77,57.79 71.37,59.18 64.64,59.18 62.99,57.53 v62.36,57.53 62.36,58.17 60.45,60.07 45.21,60.07 43.05,62.23 v40.39,62.23
V+  (via drill 0.3, 0.36)
  Top 0.152: C42.1 67.54,83.59 66.7,84.43 R9.2 | v25.65,103.5 TP9.S
  Top 0.254: 27.94,116.94 C108.1 | 28.07,130.15 C105.1 | 52.07,82.45 C97.1
  Top 0.406: v27.94,113.66 U15.P$8 27.94,116.94 | C108.1 C107.1 C106.1 | v28.07,126.87 U14.P$8 28.07,130.15 | C105.1 C104.1 C103.1 | C97.1 C96.1 C95.1 | 52.07,82.45 U13.P$8 v52.07,85.72
  Route15 0.203: v25.65,103.5 27.94,103.5
  Route15 0.406: v52.07,85.72 66.17,85.72 v68.45,83.44 | v28.07,126.87 28.07,113.79 v27.94,113.66 27.94,103.5 27.94,103.12 31.24,99.82 36.7,94.36 36.7,82.17 40.26,78.61 57.91,78.61 60.83,81.53 67.44,81.53 v69.34,83.44
  pour Top (no thermals): 66.29,81.15 66.29,82.93 67.06,82.93 68.96,85.09 71.12,85.09 71.12,80.39 67.06,80.39
V-  (via drill 0.3, 0.36)
  Top 0.152: C50.1 67.41,96.29 66.58,97.13 R11.2
  Top 0.203: TP10.S 61.98,104.14 v63.5,102.62
  Top 0.254: 31.72,108.68 U15.P$4 | U14.P$4 31.88,119.79 C111.1
  Top 0.406: C112.1 C113.1 C114.1 31.72,108.68 | C111.1 C110.1 C109.1 | C100.1 C99.1 C98.1 48,90.42 U13.P$4 v48.26,89.53 | U14.P$4 v31.88,123.06 | v31.75,109.86 U15.P$4
  Route15 0.203: v63.5,102.62 63.5,101.47
  Route15 0.406: v48.26,89.53 57.02,89.53 63.75,96.27 v68.33,96.27 | v31.88,123.06 31.75,122.94 v31.75,109.86 31.75,102.23 32.51,101.47 63.5,101.47 64.01,101.47 v69.22,96.27
  pour Top (no thermals): 66.17,93.85 66.17,95.63 66.93,95.63 68.83,97.79 70.99,97.79 70.99,93.09 66.93,93.09

## Text on the board
tNames: +12V | V+ | V- | PLL_AVDD | CLK | USB_VBUS | AVDD | LINE_OUT_SEL | AUDIO_STREAM | USB_CONNECT | DVDD | AVDD | DVDD | +1V4 | +1V0 | +4V0